# Altium project flatsat_platform_2.PrjPcb (part 1 of 2)
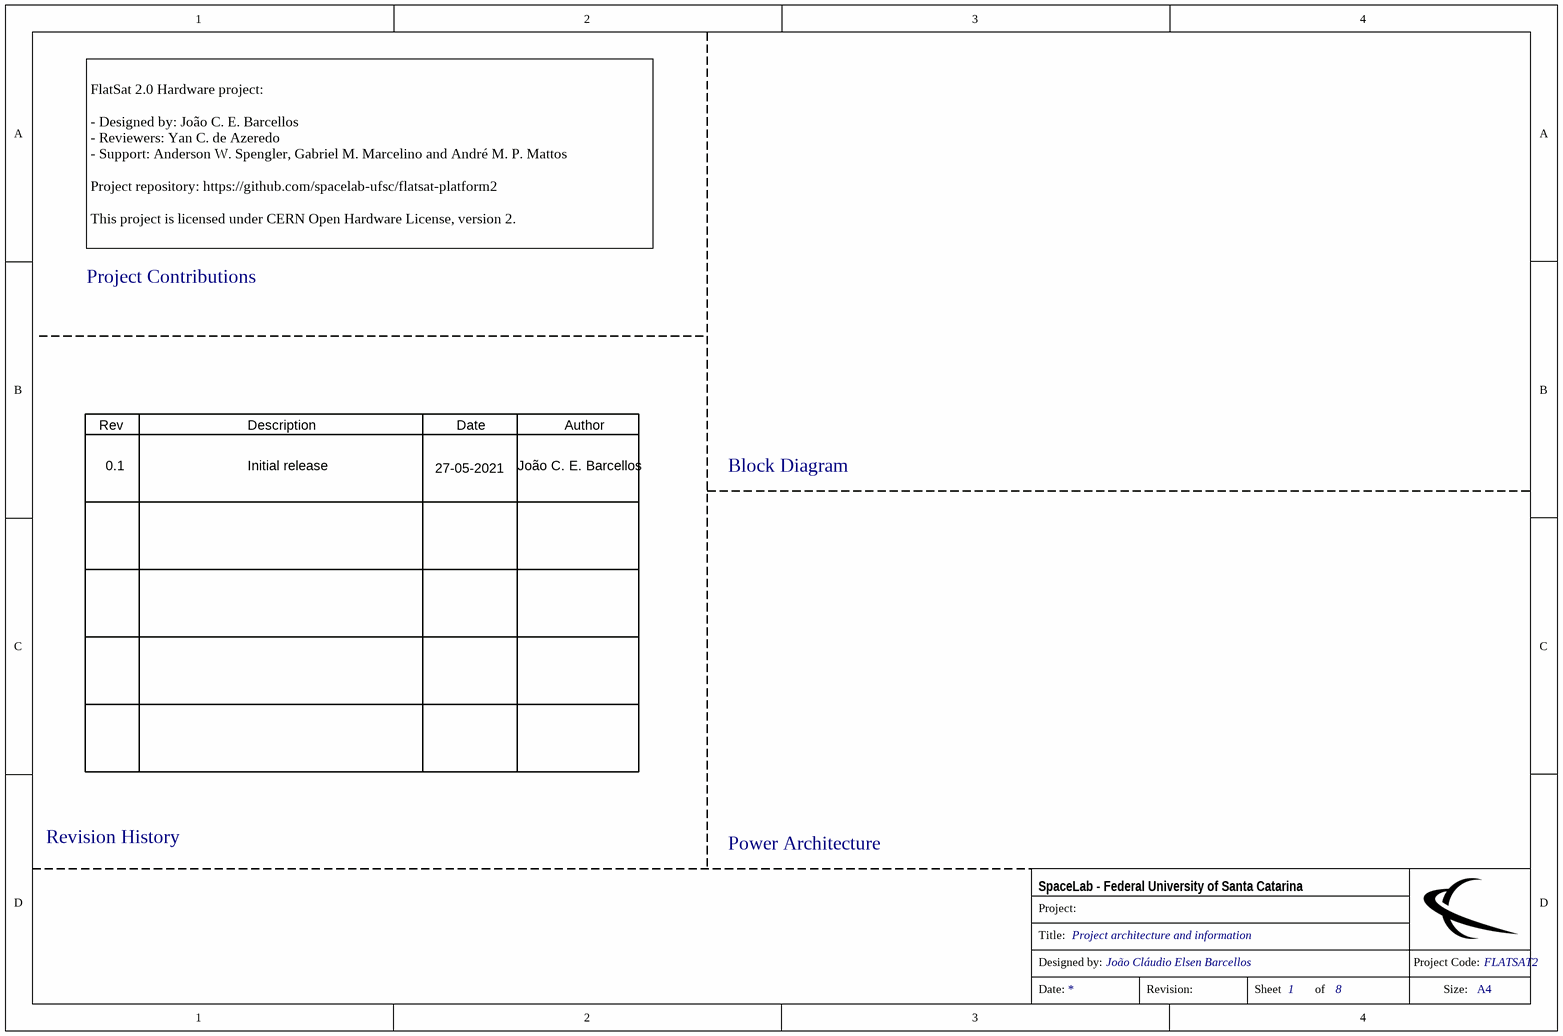
[diagram p0: architecture.SchDoc]
DesignedBy: João Cláudio Elsen Barcellos; ProjectCode: FLATSAT2; ProjectRevision: v0.1
7 sheets, 155 parts. Net scope: global (net labels, ports and power ports of the same name join across sheets).
Board file: flatsat_2_PCB.PcbDoc
Sheets:
  architecture.SchDoc
  microzed_schematic.SchDoc
  PC104_schematic.SchDoc
  voltage_level_translators_schematic.SchDoc
  CAN_schematic.SchDoc
  power_schematic.SchDoc
  kill-switches_schematic.SchDoc

## Sheet architecture.SchDoc: Project architecture and information
size A4; Organization: UFSC; DocumentNumber: 1; Revision: v0.1; SheetNumber: 1; SheetTotal: 8; ProjectCode: FLATSAT2

### Notes on the sheet
- FlatSat 2.0 Hardware project:
  - Designed by: João C. E. Barcellos
  - Reviewers: Yan C. de Azeredo
  - Support: Anderson W. Spengler, Gabriel M. Marcelino and André M. P. Mattos
  Project repository: https://github.com/spacelab-ufsc/flatsat-platform2
  This project is licensed under CERN Open Hardware License, version 2.
- Project Contributions
- Rev
- Description
- Date
- Author
- 0.1
- Initial release
- 27-05-2021
- João C. E. Barcellos
- Block Diagram
- Revision History
- Power Architecture
- Project:
- SpaceLab - Federal University of Santa Catarina
- Title:
- Designed by:
- Project Code:
- Date:
- Revision:
- Sheet
- of
- Size:
- A4

## Sheet microzed_schematic.SchDoc: Microzed Interface
size A3; Organization: Altium Limited; Address1: L3, 12a Rodborough Rd; Address2: Frenchs Forest; Address3: NSW; Address4: Australia 2086; DocumentNumber: 2; SheetNumber: 2; SheetTotal: 8
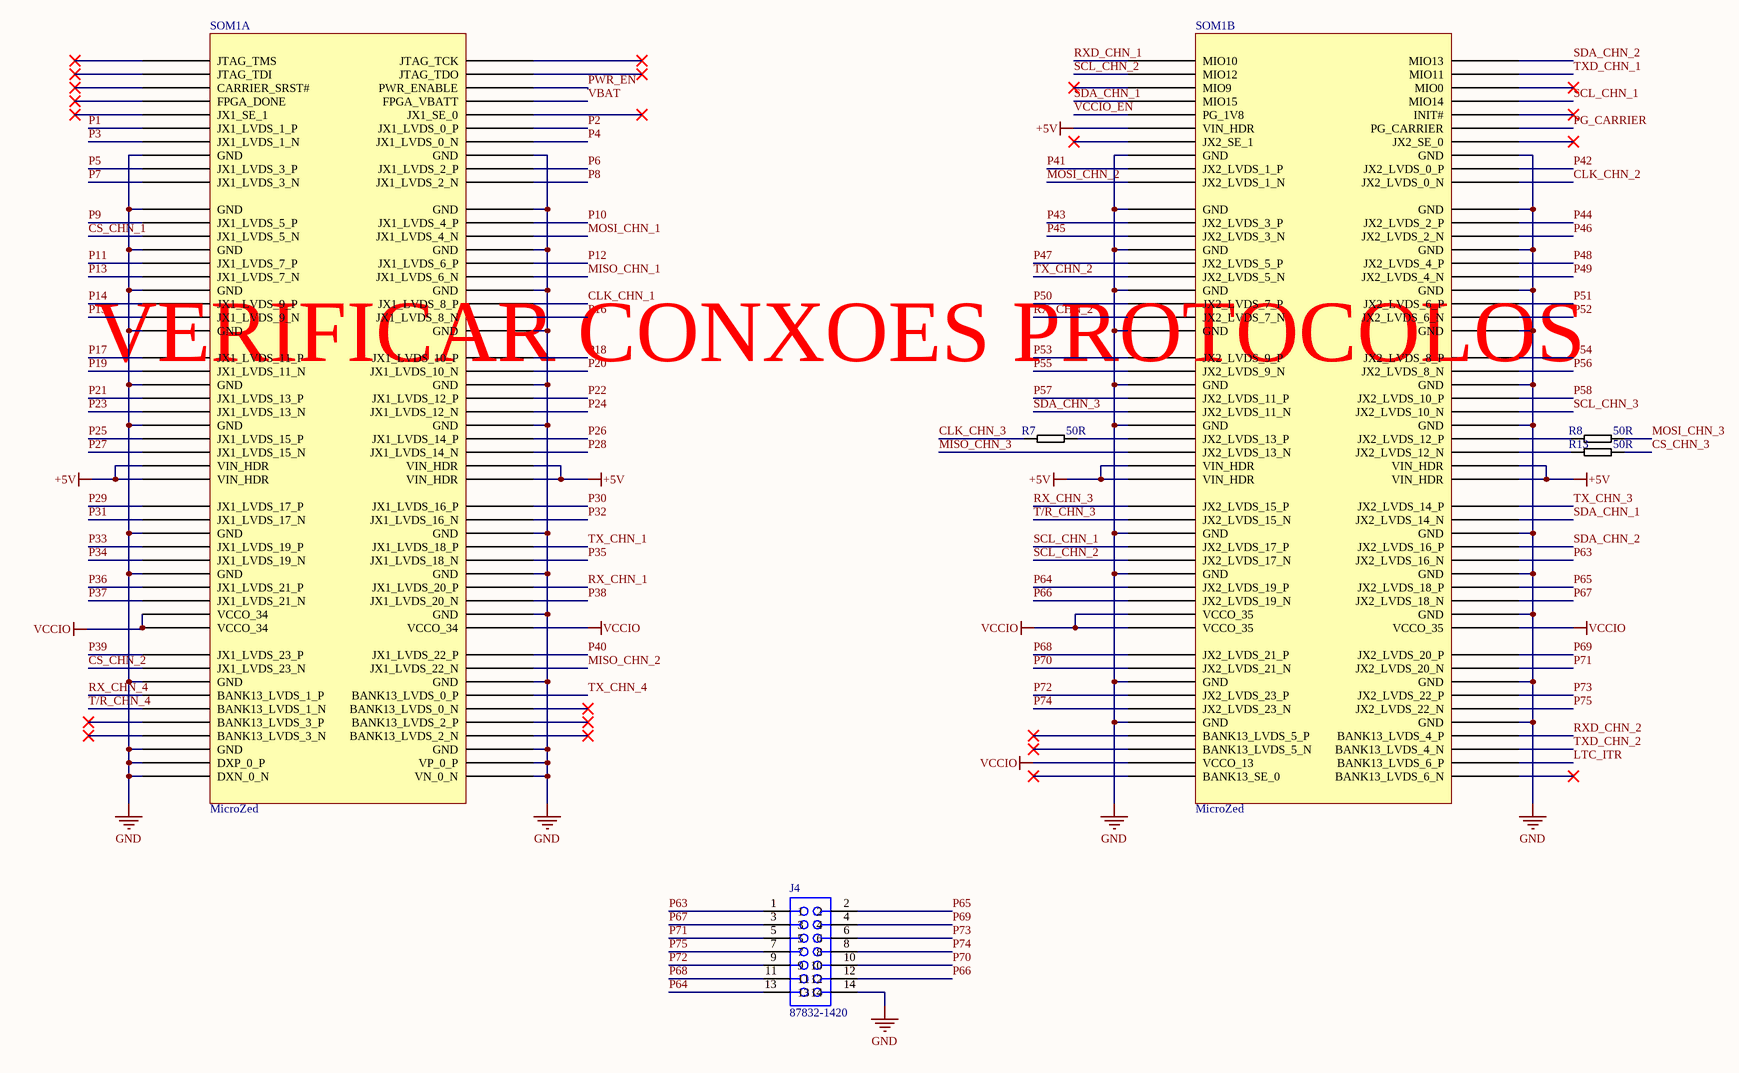
[diagram p1: microzed_schematic.SchDoc]

### Parts
J4  87832-1420  [SAMTEC_TSW-107-05-F-D]
R7  value 50R  [R0603_HD]  (hidden comment: CRCW060350R0FKEA)
R8  value 50R  [R0603_HD]  (hidden comment: CRCW060350R0FKEA)
R13  value 50R  [R0603_HD]  (hidden comment: CRCW060350R0FKEA)
SOM1  MicroZed  [MicroZedSOM]  (parts A,B of 2)

### Nets
+5V: SOM1.JX1-57(VIN_HDR) SOM1.JX1-58(VIN_HDR) SOM1.JX1-59(VIN_HDR) SOM1.JX1-60(VIN_HDR) SOM1.JX2-12(VIN_HDR) SOM1.JX2-57(VIN_HDR) SOM1.JX2-58(VIN_HDR) SOM1.JX2-59(VIN_HDR) SOM1.JX2-60(VIN_HDR)
GND: J4.14 SOM1.JX1-15(GND) SOM1.JX1-16(GND) SOM1.JX1-21(GND) SOM1.JX1-22(GND) SOM1.JX1-27(GND) SOM1.JX1-28(GND) SOM1.JX1-33(GND) SOM1.JX1-34(GND) SOM1.JX1-39(GND) SOM1.JX1-40(GND) SOM1.JX1-45(GND) SOM1.JX1-46(GND) SOM1.JX1-51(GND) SOM1.JX1-52(GND) SOM1.JX1-65(GND) SOM1.JX1-66(GND) SOM1.JX1-71(GND) SOM1.JX1-72(GND) SOM1.JX1-77(GND) SOM1.JX1-85(GND) SOM1.JX1-86(GND) SOM1.JX1-95(GND) SOM1.JX1-96(GND) SOM1.JX1-97(VP_0_P) SOM1.JX1-98(DXP_0_P) SOM1.JX1-99(VN_0_N) SOM1.JX1-100(DXN_0_N) SOM1.JX2-15(GND) SOM1.JX2-16(GND) SOM1.JX2-21(GND) SOM1.JX2-22(GND) SOM1.JX2-27(GND) SOM1.JX2-28(GND) SOM1.JX2-33(GND) SOM1.JX2-34(GND) SOM1.JX2-39(GND) SOM1.JX2-40(GND) SOM1.JX2-45(GND) SOM1.JX2-46(GND) SOM1.JX2-51(GND) SOM1.JX2-52(GND) SOM1.JX2-65(GND) SOM1.JX2-66(GND) SOM1.JX2-71(GND) SOM1.JX2-72(GND) SOM1.JX2-77(GND) SOM1.JX2-85(GND) SOM1.JX2-86(GND) SOM1.JX2-91(GND) SOM1.JX2-92(GND)
VCCIO: SOM1.JX1-78(VCCO_34) SOM1.JX1-79(VCCO_34) SOM1.JX1-80(VCCO_34) SOM1.JX2-78(VCCO_35) SOM1.JX2-79(VCCO_35) SOM1.JX2-80(VCCO_35) SOM1.JX2-98(VCCO_13)
CLK_CHN_1: SOM1.JX1-35(JX1_LVDS_8_P)
CLK_CHN_2: SOM1.JX2-19(JX2_LVDS_0_N)
CLK_CHN_3: R7.1
CS_CHN_1: SOM1.JX1-26(JX1_LVDS_5_N)
CS_CHN_2: SOM1.JX1-84(JX1_LVDS_23_N)
CS_CHN_3: R13.2
LTC_ITR: SOM1.JX2-97(BANK13_LVDS_6_P)
MISO_CHN_1: SOM1.JX1-31(JX1_LVDS_6_N)
MISO_CHN_2: SOM1.JX1-83(JX1_LVDS_22_N)
MISO_CHN_3: SOM1.JX2-56(JX2_LVDS_13_N)
MOSI_CHN_1: SOM1.JX1-25(JX1_LVDS_4_N)
MOSI_CHN_2: SOM1.JX2-20(JX2_LVDS_1_N)
MOSI_CHN_3: R8.2
P1: SOM1.JX1-12(JX1_LVDS_1_P)
P2: SOM1.JX1-11(JX1_LVDS_0_P)
P3: SOM1.JX1-14(JX1_LVDS_1_N)
P4: SOM1.JX1-13(JX1_LVDS_0_N)
P5: SOM1.JX1-18(JX1_LVDS_3_P)
P6: SOM1.JX1-17(JX1_LVDS_2_P)
P7: SOM1.JX1-20(JX1_LVDS_3_N)
P8: SOM1.JX1-19(JX1_LVDS_2_N)
P9: SOM1.JX1-24(JX1_LVDS_5_P)
P10: SOM1.JX1-23(JX1_LVDS_4_P)
P11: SOM1.JX1-30(JX1_LVDS_7_P)
P12: SOM1.JX1-29(JX1_LVDS_6_P)
P13: SOM1.JX1-32(JX1_LVDS_7_N)
P14: SOM1.JX1-36(JX1_LVDS_9_P)
P15: SOM1.JX1-38(JX1_LVDS_9_N)
P16: SOM1.JX1-37(JX1_LVDS_8_N)
P17: SOM1.JX1-42(JX1_LVDS_11_P)
P18: SOM1.JX1-41(JX1_LVDS_10_P)
P19: SOM1.JX1-44(JX1_LVDS_11_N)
P20: SOM1.JX1-43(JX1_LVDS_10_N)
P21: SOM1.JX1-48(JX1_LVDS_13_P)
P22: SOM1.JX1-47(JX1_LVDS_12_P)
P23: SOM1.JX1-50(JX1_LVDS_13_N)
P24: SOM1.JX1-49(JX1_LVDS_12_N)
P25: SOM1.JX1-54(JX1_LVDS_15_P)
P26: SOM1.JX1-53(JX1_LVDS_14_P)
P27: SOM1.JX1-56(JX1_LVDS_15_N)
P28: SOM1.JX1-55(JX1_LVDS_14_N)
P29: SOM1.JX1-62(JX1_LVDS_17_P)
P30: SOM1.JX1-61(JX1_LVDS_16_P)
P31: SOM1.JX1-64(JX1_LVDS_17_N)
P32: SOM1.JX1-63(JX1_LVDS_16_N)
P33: SOM1.JX1-68(JX1_LVDS_19_P)
P34: SOM1.JX1-70(JX1_LVDS_19_N)
P35: SOM1.JX1-69(JX1_LVDS_18_N)
P36: SOM1.JX1-74(JX1_LVDS_21_P)
P37: SOM1.JX1-76(JX1_LVDS_21_N)
P38: SOM1.JX1-75(JX1_LVDS_20_N)
P39: SOM1.JX1-82(JX1_LVDS_23_P)
P40: SOM1.JX1-81(JX1_LVDS_22_P)
P41: SOM1.JX2-18(JX2_LVDS_1_P)
P42: SOM1.JX2-17(JX2_LVDS_0_P)
P43: SOM1.JX2-24(JX2_LVDS_3_P)
P44: SOM1.JX2-23(JX2_LVDS_2_P)
P45: SOM1.JX2-26(JX2_LVDS_3_N)
P46: SOM1.JX2-25(JX2_LVDS_2_N)
P47: SOM1.JX2-30(JX2_LVDS_5_P)
P48: SOM1.JX2-29(JX2_LVDS_4_P)
P49: SOM1.JX2-31(JX2_LVDS_4_N)
P50: SOM1.JX2-36(JX2_LVDS_7_P)
P51: SOM1.JX2-35(JX2_LVDS_6_P)
P52: SOM1.JX2-37(JX2_LVDS_6_N)
P53: SOM1.JX2-42(JX2_LVDS_9_P)
P54: SOM1.JX2-41(JX2_LVDS_8_P)
P55: SOM1.JX2-44(JX2_LVDS_9_N)
P56: SOM1.JX2-43(JX2_LVDS_8_N)
P57: SOM1.JX2-48(JX2_LVDS_11_P)
P58: SOM1.JX2-47(JX2_LVDS_10_P)
P63: J4.1 SOM1.JX2-69(JX2_LVDS_16_N)
P64: J4.13 SOM1.JX2-74(JX2_LVDS_19_P)
P65: J4.2 SOM1.JX2-73(JX2_LVDS_18_P)
P66: J4.12 SOM1.JX2-76(JX2_LVDS_19_N)
P67: J4.3 SOM1.JX2-75(JX2_LVDS_18_N)
P68: J4.11 SOM1.JX2-82(JX2_LVDS_21_P)
P69: J4.4 SOM1.JX2-81(JX2_LVDS_20_P)
P70: J4.10 SOM1.JX2-84(JX2_LVDS_21_N)
P71: J4.5 SOM1.JX2-83(JX2_LVDS_20_N)
P72: J4.9 SOM1.JX2-88(JX2_LVDS_23_P)
P73: J4.6 SOM1.JX2-87(JX2_LVDS_22_P)
P74: J4.8 SOM1.JX2-90(JX2_LVDS_23_N)
P75: J4.7 SOM1.JX2-89(JX2_LVDS_22_N)
PG_CARRIER: SOM1.JX2-11(PG_CARRIER)
PWR_EN: SOM1.JX1-5(PWR_ENABLE)
RX_CHN_1: SOM1.JX1-73(JX1_LVDS_20_P)
RX_CHN_2: SOM1.JX2-38(JX2_LVDS_7_N)
RX_CHN_3: SOM1.JX2-62(JX2_LVDS_15_P)
RX_CHN_4: SOM1.JX1-88(BANK13_LVDS_1_P)
RXD_CHN_1: SOM1.JX2-2(MIO10)
RXD_CHN_2: SOM1.JX2-93(BANK13_LVDS_4_P)
SCL_CHN_1: SOM1.JX2-7(MIO14) SOM1.JX2-68(JX2_LVDS_17_P)
SCL_CHN_2: SOM1.JX2-4(MIO12) SOM1.JX2-70(JX2_LVDS_17_N)
SCL_CHN_3: SOM1.JX2-49(JX2_LVDS_10_N)
SDA_CHN_1: SOM1.JX2-8(MIO15) SOM1.JX2-63(JX2_LVDS_14_N)
SDA_CHN_2: SOM1.JX2-1(MIO13) SOM1.JX2-67(JX2_LVDS_16_P)
SDA_CHN_3: SOM1.JX2-50(JX2_LVDS_11_N)
T/R_CHN_3: SOM1.JX2-64(JX2_LVDS_15_N)
T/R_CHN_4: SOM1.JX1-90(BANK13_LVDS_1_N)
TX_CHN_1: SOM1.JX1-67(JX1_LVDS_18_P)
TX_CHN_2: SOM1.JX2-32(JX2_LVDS_5_N)
TX_CHN_3: SOM1.JX2-61(JX2_LVDS_14_P)
TX_CHN_4: SOM1.JX1-87(BANK13_LVDS_0_P)
TXD_CHN_1: SOM1.JX2-3(MIO11)
TXD_CHN_2: SOM1.JX2-95(BANK13_LVDS_4_N)
VBAT: SOM1.JX1-7(FPGA_VBATT)
VCCIO_EN: SOM1.JX2-10(PG_1V8)
NetR7_2: R7.2 SOM1.JX2-54(JX2_LVDS_13_P)
NetR8_1: R8.1 SOM1.JX2-53(JX2_LVDS_12_P)
NetR13_1: R13.1 SOM1.JX2-55(JX2_LVDS_12_N)

Not connected (* = marked no-connect by the designer): SOM1 JX1-1(JTAG_TCK)* JX1-2(JTAG_TMS)* JX1-3(JTAG_TDO)* JX1-4(JTAG_TDI)* JX1-6(CARRIER_SRST#)* JX1-8(FPGA_DONE)* JX1-9(JX1_SE_0)* JX1-10(JX1_SE_1)* JX1-89(BANK13_LVDS_0_N)* JX1-91(BANK13_LVDS_2_P)* JX1-92(BANK13_LVDS_3_P)* JX1-93(BANK13_LVDS_2_N)* JX1-94(BANK13_LVDS_3_N)* JX2-5(MIO0)* JX2-6(MIO9)* JX2-9(INIT#)* JX2-13(JX2_SE_0)* JX2-14(JX2_SE_1)* JX2-94(BANK13_LVDS_5_P)* JX2-96(BANK13_LVDS_5_N)* JX2-99(BANK13_LVDS_6_N)* JX2-100(BANK13_SE_0)*

### Notes on the sheet
- (near SOM1) VERIFICAR CONXOES PROTOCOLOS
- Project:
- SpaceLab - Federal University of Santa Catarina
- Title:
- Engineer:
- Project Code:
- Date:
- Revision:
- Sheet
- of
- Size:
- A3

### Library data of the parts
J4 = 87832-1420: Connector Header Surface Mount 14 position 0.079 _2.00mm_; Manufacturer Part Number: TSW-107-05-F-D; MF: Molex; Value: *; SnapEDA_Link: https://www.snapeda.com/parts/87832-1420/Molex/view-part/78740/?ref=snap; Price: None; Package: None; Availability: Unavailable
R7 R8 R13 = CRCW060350R0FKEA: RES SMD 50 OHM 1% 1/10W 0603; Manufacturer: Vishay Dale; Mount Type: SMD; Tolerance: 1%; Supplier 1: Digi-Key; Supplier Part Number 1: 541-3318-1-ND; Power: 1/10W
SOM1 = MicroZed_SOM: MicroZed SOM Carrier Footprint; Manufacturer Part Number: 61083-101400LF

## Sheet PC104_schematic.SchDoc: PC104 Interfaces
size A2; DocumentNumber: 3; SheetNumber: 3; SheetTotal: 8
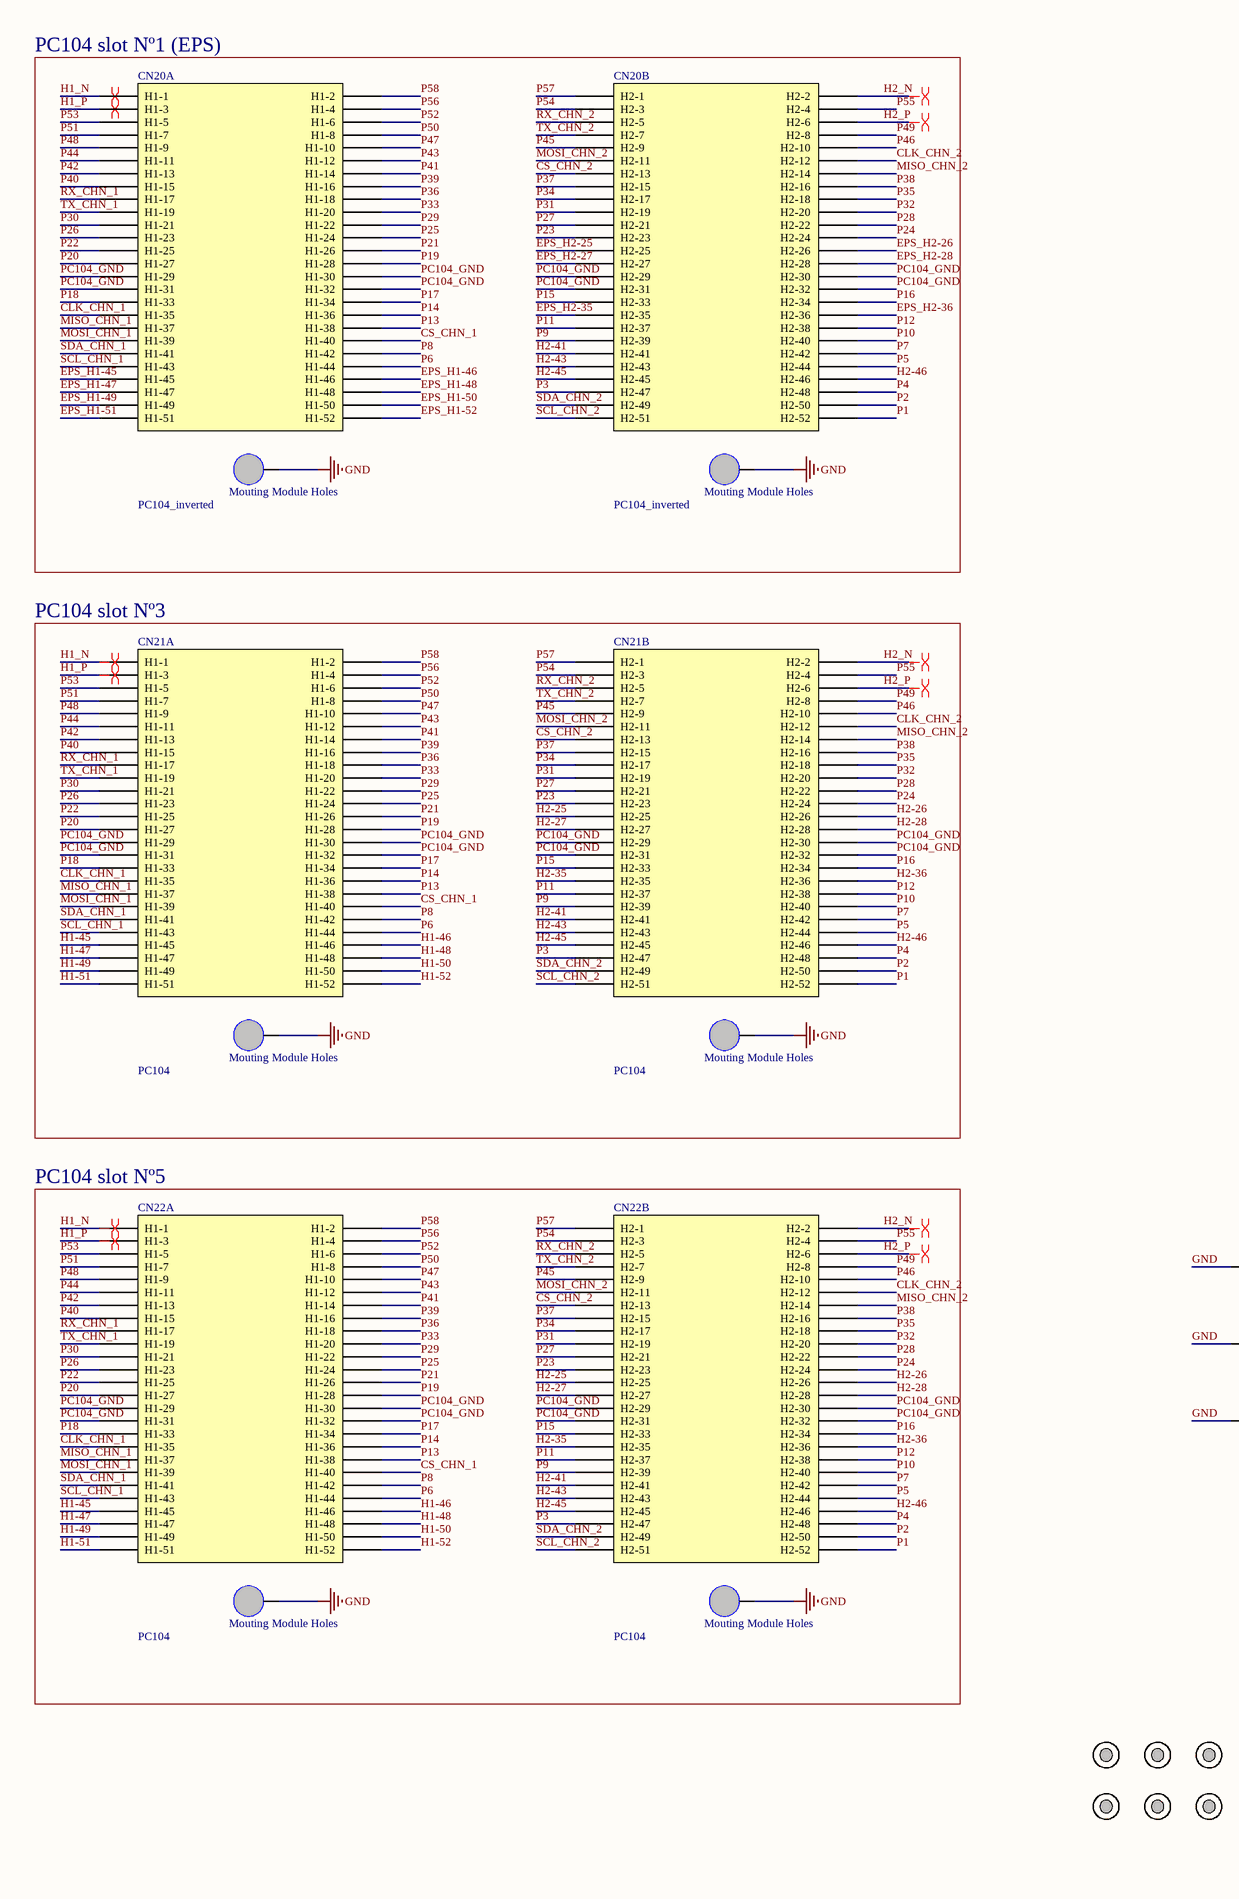
[diagram p2: PC104_schematic.SchDoc, left]
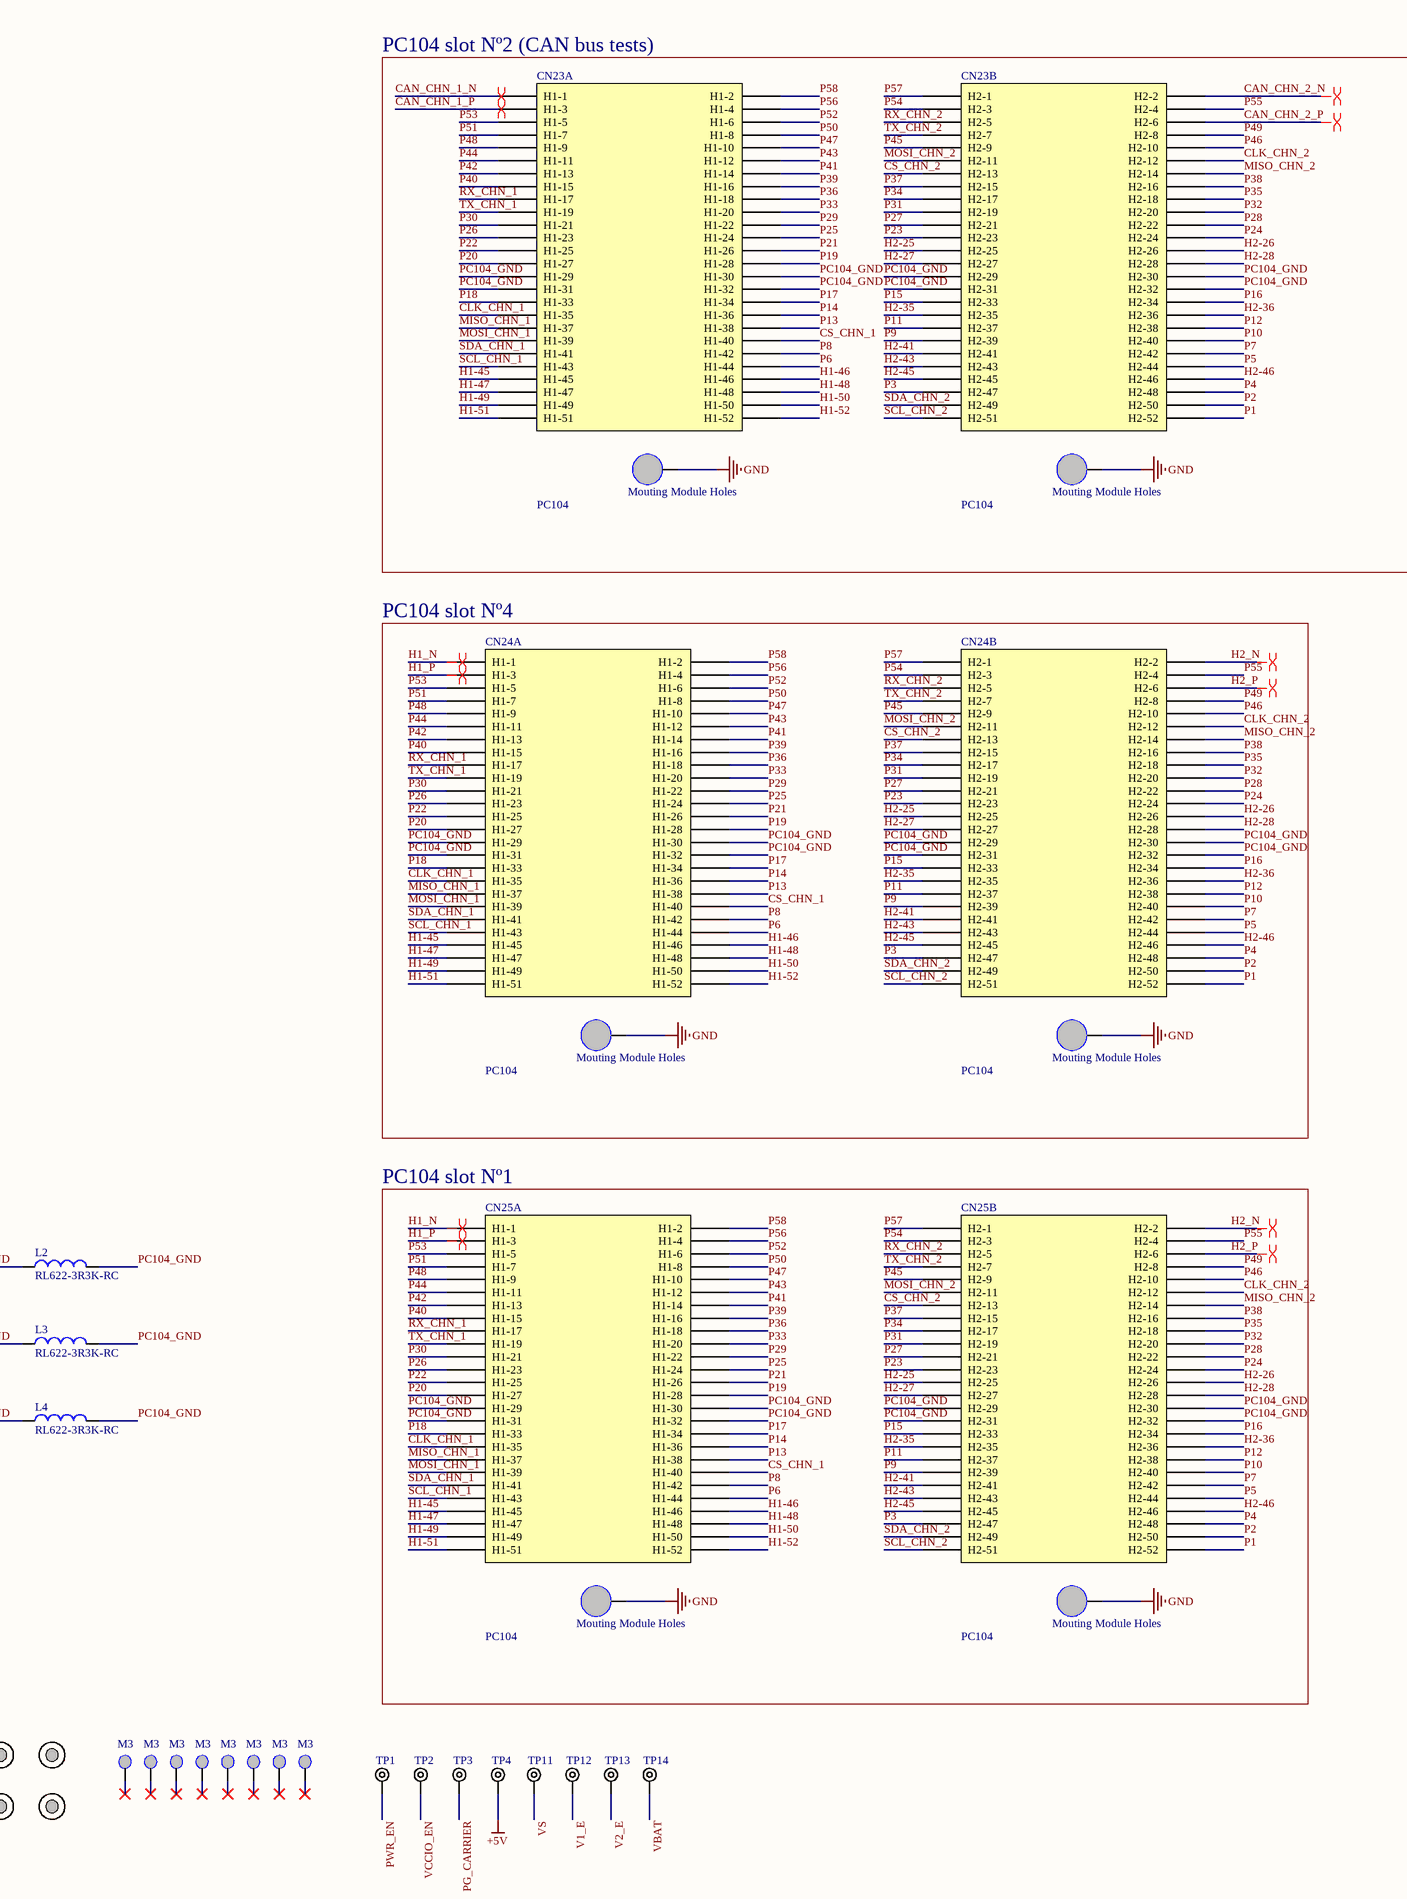
[diagram p3: PC104_schematic.SchDoc, right]

### Parts
CN20  PC104_inverted  [PC104_inverted]  (parts A,B of 2)
CN21  PC104  [PC104]  (parts A,B of 2)
CN22  PC104  [PC104]  (parts A,B of 2)
CN23  PC104  [PC104]  (parts A,B of 2)
CN24  PC104  [PC104]  (parts A,B of 2)
CN25  PC104  [PC104]  (parts A,B of 2)
FD1  Fiducial 1.3  [Fiducial 1.3mm]  (value not drawn)  (no BOM)
FD2  Fiducial 1.3  [Fiducial 1.3mm]  (value not drawn)  (no BOM)
FD3  Fiducial 1.3  [Fiducial 1.3mm]  (value not drawn)  (no BOM)
FD4  Fiducial 1.3  [Fiducial 1.3mm]  (value not drawn)  (no BOM)
FD5  Fiducial 1.3  [Fiducial 1.3mm]  (value not drawn)  (no BOM)
FD6  Fiducial 1.3  [Fiducial 1.3mm]  (value not drawn)  (no BOM)
FD7  Fiducial 1.3  [Fiducial 1.3mm]  (value not drawn)  (no BOM)
FD8  Fiducial 1.3  [Fiducial 1.3mm]  (value not drawn)  (no BOM)
L2  RL622-3R3K-RC  [RL622]
L3  RL622-3R3K-RC  [RL622]
L4  RL622-3R3K-RC  [RL622]
MEC1  M3  [M3 hole]  (no BOM)
MEC2  M3  [M3 hole]  (no BOM)
MEC3  M3  [M3 hole]  (no BOM)
MEC4  M3  [M3 hole]  (no BOM)
MEC5  M3  [M3 hole]  (no BOM)
MEC6  M3  [M3 hole]  (no BOM)
MEC7  M3  [M3 hole]  (no BOM)
MEC8  M3  [M3 hole]  (no BOM)
TP1  (no value)  [TEST POINT PTH]  (no BOM)
TP2  (no value)  [TEST POINT PTH]  (no BOM)
TP3  (no value)  [TEST POINT PTH]  (no BOM)
TP4  (no value)  [TEST POINT PTH]  (no BOM)
TP11  (no value)  [TEST POINT PTH]  (no BOM)
TP12  (no value)  [TEST POINT PTH]  (no BOM)
TP13  (no value)  [TEST POINT PTH]  (no BOM)
TP14  (no value)  [TEST POINT PTH]  (no BOM)

### Blocks framed on the sheet
PC104 slot Nº1 (EPS): CN20
PC104 slot Nº2 (CAN bus tests): CN23
PC104 slot Nº3: CN21
PC104 slot Nº4: CN24
PC104 slot Nº5: CN22
PC104 slot Nº1: CN25

### Nets
+5V: TP4.1
GND: CN20.0(Mouting) CN21.0(Mouting) CN22.0(Mouting) CN23.0(Mouting) CN24.0(Mouting) CN25.0(Mouting) L2.1 L3.1 L4.1
CAN_CHN_1_N: CN23.1(H1-1)
CAN_CHN_1_P: CN23.3(H1-3)
CAN_CHN_2_N: CN23.54(H2-2)
CAN_CHN_2_P: CN23.58(H2-6)
CLK_CHN_1: CN20.35(H1-35) CN21.35(H1-35) CN22.35(H1-35) CN23.35(H1-35) CN24.35(H1-35) CN25.35(H1-35)
CLK_CHN_2: CN20.64(H2-12) CN21.64(H2-12) CN22.64(H2-12) CN23.64(H2-12) CN24.64(H2-12) CN25.64(H2-12)
CS_CHN_1: CN20.40(H1-40) CN21.40(H1-40) CN22.40(H1-40) CN23.40(H1-40) CN24.40(H1-40) CN25.40(H1-40)
CS_CHN_2: CN20.65(H2-13) CN21.65(H2-13) CN22.65(H2-13) CN23.65(H2-13) CN24.65(H2-13) CN25.65(H2-13)
EPS_H1-45: CN20.45(H1-45) CN20.46(H1-46)  [also labelled EPS_H1-46]
EPS_H1-47: CN20.47(H1-47) CN20.48(H1-48)  [also labelled EPS_H1-48]
EPS_H1-49: CN20.49(H1-49) CN20.50(H1-50)  [also labelled EPS_H1-50]
EPS_H1-51: CN20.51(H1-51) CN20.52(H1-52)  [also labelled EPS_H1-52]
EPS_H2-25: CN20.77(H2-25) CN20.78(H2-26)  [also labelled EPS_H2-26]
EPS_H2-27: CN20.79(H2-27) CN20.80(H2-28)  [also labelled EPS_H2-28]
EPS_H2-35: CN20.87(H2-35) CN20.88(H2-36)  [also labelled EPS_H2-36]
H1-45: CN21.45(H1-45) CN21.46(H1-46) CN22.45(H1-45) CN22.46(H1-46) CN23.45(H1-45) CN23.46(H1-46) CN24.45(H1-45) CN24.46(H1-46) CN25.45(H1-45) CN25.46(H1-46)  [also labelled H1-46]
H1-47: CN21.47(H1-47) CN21.48(H1-48) CN22.47(H1-47) CN22.48(H1-48) CN23.47(H1-47) CN23.48(H1-48) CN24.47(H1-47) CN24.48(H1-48) CN25.47(H1-47) CN25.48(H1-48)  [also labelled H1-48]
H1-49: CN21.49(H1-49) CN21.50(H1-50) CN22.49(H1-49) CN22.50(H1-50) CN23.49(H1-49) CN23.50(H1-50) CN24.49(H1-49) CN24.50(H1-50) CN25.49(H1-49) CN25.50(H1-50)  [also labelled H1-50]
H1-51: CN21.51(H1-51) CN21.52(H1-52) CN22.51(H1-51) CN22.52(H1-52) CN23.51(H1-51) CN23.52(H1-52) CN24.51(H1-51) CN24.52(H1-52) CN25.51(H1-51) CN25.52(H1-52)  [also labelled H1-52]
H1_N: CN20.1(H1-1) CN21.1(H1-1) CN22.1(H1-1) CN24.1(H1-1) CN25.1(H1-1)
H1_P: CN20.3(H1-3) CN21.3(H1-3) CN22.3(H1-3) CN24.3(H1-3) CN25.3(H1-3)
H2-25: CN21.77(H2-25) CN21.78(H2-26) CN22.77(H2-25) CN22.78(H2-26) CN23.77(H2-25) CN23.78(H2-26) CN24.77(H2-25) CN24.78(H2-26) CN25.77(H2-25) CN25.78(H2-26)  [also labelled H2-26]
H2-27: CN21.79(H2-27) CN21.80(H2-28) CN22.79(H2-27) CN22.80(H2-28) CN23.79(H2-27) CN23.80(H2-28) CN24.79(H2-27) CN24.80(H2-28) CN25.79(H2-27) CN25.80(H2-28)  [also labelled H2-28]
H2-35: CN21.87(H2-35) CN21.88(H2-36) CN22.87(H2-35) CN22.88(H2-36) CN23.87(H2-35) CN23.88(H2-36) CN24.87(H2-35) CN24.88(H2-36) CN25.87(H2-35) CN25.88(H2-36)  [also labelled H2-36]
H2-41: CN20.93(H2-41) CN21.93(H2-41) CN22.93(H2-41) CN23.93(H2-41) CN24.93(H2-41) CN25.93(H2-41)
H2-43: CN20.95(H2-43) CN21.95(H2-43) CN22.95(H2-43) CN23.95(H2-43) CN24.95(H2-43) CN25.95(H2-43)
H2-45: CN20.97(H2-45) CN21.97(H2-45) CN22.97(H2-45) CN23.97(H2-45) CN24.97(H2-45) CN25.97(H2-45)
H2-46: CN20.98(H2-46) CN21.98(H2-46) CN22.98(H2-46) CN23.98(H2-46) CN24.98(H2-46) CN25.98(H2-46)
H2_N: CN20.54(H2-2) CN21.54(H2-2) CN22.54(H2-2) CN24.54(H2-2) CN25.54(H2-2)
H2_P: CN20.58(H2-6) CN21.58(H2-6) CN22.58(H2-6) CN24.58(H2-6) CN25.58(H2-6)
MISO_CHN_1: CN20.37(H1-37) CN21.37(H1-37) CN22.37(H1-37) CN23.37(H1-37) CN24.37(H1-37) CN25.37(H1-37)
MISO_CHN_2: CN20.66(H2-14) CN21.66(H2-14) CN22.66(H2-14) CN23.66(H2-14) CN24.66(H2-14) CN25.66(H2-14)
MOSI_CHN_1: CN20.39(H1-39) CN21.39(H1-39) CN22.39(H1-39) CN23.39(H1-39) CN24.39(H1-39) CN25.39(H1-39)
MOSI_CHN_2: CN20.63(H2-11) CN21.63(H2-11) CN22.63(H2-11) CN23.63(H2-11) CN24.63(H2-11) CN25.63(H2-11)
P1: CN20.104(H2-52) CN21.104(H2-52) CN22.104(H2-52) CN23.104(H2-52) CN24.104(H2-52) CN25.104(H2-52)
P2: CN20.102(H2-50) CN21.102(H2-50) CN22.102(H2-50) CN23.102(H2-50) CN24.102(H2-50) CN25.102(H2-50)
P3: CN20.99(H2-47) CN21.99(H2-47) CN22.99(H2-47) CN23.99(H2-47) CN24.99(H2-47) CN25.99(H2-47)
P4: CN20.100(H2-48) CN21.100(H2-48) CN22.100(H2-48) CN23.100(H2-48) CN24.100(H2-48) CN25.100(H2-48)
P5: CN20.96(H2-44) CN21.96(H2-44) CN22.96(H2-44) CN23.96(H2-44) CN24.96(H2-44) CN25.96(H2-44)
P6: CN20.44(H1-44) CN21.44(H1-44) CN22.44(H1-44) CN23.44(H1-44) CN24.44(H1-44) CN25.44(H1-44)
P7: CN20.94(H2-42) CN21.94(H2-42) CN22.94(H2-42) CN23.94(H2-42) CN24.94(H2-42) CN25.94(H2-42)
P8: CN20.42(H1-42) CN21.42(H1-42) CN22.42(H1-42) CN23.42(H1-42) CN24.42(H1-42) CN25.42(H1-42)
P9: CN20.91(H2-39) CN21.91(H2-39) CN22.91(H2-39) CN23.91(H2-39) CN24.91(H2-39) CN25.91(H2-39)
P10: CN20.92(H2-40) CN21.92(H2-40) CN22.92(H2-40) CN23.92(H2-40) CN24.92(H2-40) CN25.92(H2-40)
P11: CN20.89(H2-37) CN21.89(H2-37) CN22.89(H2-37) CN23.89(H2-37) CN24.89(H2-37) CN25.89(H2-37)
P12: CN20.90(H2-38) CN21.90(H2-38) CN22.90(H2-38) CN23.90(H2-38) CN24.90(H2-38) CN25.90(H2-38)
P13: CN20.38(H1-38) CN21.38(H1-38) CN22.38(H1-38) CN23.38(H1-38) CN24.38(H1-38) CN25.38(H1-38)
P14: CN20.36(H1-36) CN21.36(H1-36) CN22.36(H1-36) CN23.36(H1-36) CN24.36(H1-36) CN25.36(H1-36)
P15: CN20.85(H2-33) CN21.85(H2-33) CN22.85(H2-33) CN23.85(H2-33) CN24.85(H2-33) CN25.85(H2-33)
P16: CN20.86(H2-34) CN21.86(H2-34) CN22.86(H2-34) CN23.86(H2-34) CN24.86(H2-34) CN25.86(H2-34)
P17: CN20.34(H1-34) CN21.34(H1-34) CN22.34(H1-34) CN23.34(H1-34) CN24.34(H1-34) CN25.34(H1-34)
P18: CN20.33(H1-33) CN21.33(H1-33) CN22.33(H1-33) CN23.33(H1-33) CN24.33(H1-33) CN25.33(H1-33)
P19: CN20.28(H1-28) CN21.28(H1-28) CN22.28(H1-28) CN23.28(H1-28) CN24.28(H1-28) CN25.28(H1-28)
P20: CN20.27(H1-27) CN21.27(H1-27) CN22.27(H1-27) CN23.27(H1-27) CN24.27(H1-27) CN25.27(H1-27)
P21: CN20.26(H1-26) CN21.26(H1-26) CN22.26(H1-26) CN23.26(H1-26) CN24.26(H1-26) CN25.26(H1-26)
P22: CN20.25(H1-25) CN21.25(H1-25) CN22.25(H1-25) CN23.25(H1-25) CN24.25(H1-25) CN25.25(H1-25)
P23: CN20.75(H2-23) CN21.75(H2-23) CN22.75(H2-23) CN23.75(H2-23) CN24.75(H2-23) CN25.75(H2-23)
P24: CN20.76(H2-24) CN21.76(H2-24) CN22.76(H2-24) CN23.76(H2-24) CN24.76(H2-24) CN25.76(H2-24)
P25: CN20.24(H1-24) CN21.24(H1-24) CN22.24(H1-24) CN23.24(H1-24) CN24.24(H1-24) CN25.24(H1-24)
P26: CN20.23(H1-23) CN21.23(H1-23) CN22.23(H1-23) CN23.23(H1-23) CN24.23(H1-23) CN25.23(H1-23)
P27: CN20.73(H2-21) CN21.73(H2-21) CN22.73(H2-21) CN23.73(H2-21) CN24.73(H2-21) CN25.73(H2-21)
P28: CN20.74(H2-22) CN21.74(H2-22) CN22.74(H2-22) CN23.74(H2-22) CN24.74(H2-22) CN25.74(H2-22)
P29: CN20.22(H1-22) CN21.22(H1-22) CN22.22(H1-22) CN23.22(H1-22) CN24.22(H1-22) CN25.22(H1-22)
P30: CN20.21(H1-21) CN21.21(H1-21) CN22.21(H1-21) CN23.21(H1-21) CN24.21(H1-21) CN25.21(H1-21)
P31: CN20.71(H2-19) CN21.71(H2-19) CN22.71(H2-19) CN23.71(H2-19) CN24.71(H2-19) CN25.71(H2-19)
P32: CN20.72(H2-20) CN21.72(H2-20) CN22.72(H2-20) CN23.72(H2-20) CN24.72(H2-20) CN25.72(H2-20)
P33: CN20.20(H1-20) CN21.20(H1-20) CN22.20(H1-20) CN23.20(H1-20) CN24.20(H1-20) CN25.20(H1-20)
P34: CN20.69(H2-17) CN21.69(H2-17) CN22.69(H2-17) CN23.69(H2-17) CN24.69(H2-17) CN25.69(H2-17)
P35: CN20.70(H2-18) CN21.70(H2-18) CN22.70(H2-18) CN23.70(H2-18) CN24.70(H2-18) CN25.70(H2-18)
P36: CN20.18(H1-18) CN21.18(H1-18) CN22.18(H1-18) CN23.18(H1-18) CN24.18(H1-18) CN25.18(H1-18)
P37: CN20.67(H2-15) CN21.67(H2-15) CN22.67(H2-15) CN23.67(H2-15) CN24.67(H2-15) CN25.67(H2-15)
P38: CN20.68(H2-16) CN21.68(H2-16) CN22.68(H2-16) CN23.68(H2-16) CN24.68(H2-16) CN25.68(H2-16)
P39: CN20.16(H1-16) CN21.16(H1-16) CN22.16(H1-16) CN23.16(H1-16) CN24.16(H1-16) CN25.16(H1-16)
P40: CN20.15(H1-15) CN21.15(H1-15) CN22.15(H1-15) CN23.15(H1-15) CN24.15(H1-15) CN25.15(H1-15)
P41: CN20.14(H1-14) CN21.14(H1-14) CN22.14(H1-14) CN23.14(H1-14) CN24.14(H1-14) CN25.14(H1-14)
P42: CN20.13(H1-13) CN21.13(H1-13) CN22.13(H1-13) CN23.13(H1-13) CN24.13(H1-13) CN25.13(H1-13)
P43: CN20.12(H1-12) CN21.12(H1-12) CN22.12(H1-12) CN23.12(H1-12) CN24.12(H1-12) CN25.12(H1-12)
P44: CN20.11(H1-11) CN21.11(H1-11) CN22.11(H1-11) CN23.11(H1-11) CN24.11(H1-11) CN25.11(H1-11)
P45: CN20.61(H2-9) CN21.61(H2-9) CN22.61(H2-9) CN23.61(H2-9) CN24.61(H2-9) CN25.61(H2-9)
P46: CN20.62(H2-10) CN21.62(H2-10) CN22.62(H2-10) CN23.62(H2-10) CN24.62(H2-10) CN25.62(H2-10)
P47: CN20.10(H1-10) CN21.10(H1-10) CN22.10(H1-10) CN23.10(H1-10) CN24.10(H1-10) CN25.10(H1-10)
P48: CN20.9(H1-9) CN21.9(H1-9) CN22.9(H1-9) CN23.9(H1-9) CN24.9(H1-9) CN25.9(H1-9)
P49: CN20.60(H2-8) CN21.60(H2-8) CN22.60(H2-8) CN23.60(H2-8) CN24.60(H2-8) CN25.60(H2-8)
P50: CN20.8(H1-8) CN21.8(H1-8) CN22.8(H1-8) CN23.8(H1-8) CN24.8(H1-8) CN25.8(H1-8)
P51: CN20.7(H1-7) CN21.7(H1-7) CN22.7(H1-7) CN23.7(H1-7) CN24.7(H1-7) CN25.7(H1-7)
P52: CN20.6(H1-6) CN21.6(H1-6) CN22.6(H1-6) CN23.6(H1-6) CN24.6(H1-6) CN25.6(H1-6)
P53: CN20.5(H1-5) CN21.5(H1-5) CN22.5(H1-5) CN23.5(H1-5) CN24.5(H1-5) CN25.5(H1-5)
P54: CN20.55(H2-3) CN21.55(H2-3) CN22.55(H2-3) CN23.55(H2-3) CN24.55(H2-3) CN25.55(H2-3)
P55: CN20.56(H2-4) CN21.56(H2-4) CN22.56(H2-4) CN23.56(H2-4) CN24.56(H2-4) CN25.56(H2-4)
P56: CN20.4(H1-4) CN21.4(H1-4) CN22.4(H1-4) CN23.4(H1-4) CN24.4(H1-4) CN25.4(H1-4)
P57: CN20.53(H2-1) CN21.53(H2-1) CN22.53(H2-1) CN23.53(H2-1) CN24.53(H2-1) CN25.53(H2-1)
P58: CN20.2(H1-2) CN21.2(H1-2) CN22.2(H1-2) CN23.2(H1-2) CN24.2(H1-2) CN25.2(H1-2)
PC104_GND: CN20.29(H1-29) CN20.30(H1-30) CN20.31(H1-31) CN20.32(H1-32) CN20.81(H2-29) CN20.82(H2-30) CN20.83(H2-31) CN20.84(H2-32) CN21.29(H1-29) CN21.30(H1-30) CN21.31(H1-31) CN21.32(H1-32) CN21.81(H2-29) CN21.82(H2-30) CN21.83(H2-31) CN21.84(H2-32) CN22.29(H1-29) CN22.30(H1-30) CN22.31(H1-31) CN22.32(H1-32) CN22.81(H2-29) CN22.82(H2-30) CN22.83(H2-31) CN22.84(H2-32) CN23.29(H1-29) CN23.30(H1-30) CN23.31(H1-31) CN23.32(H1-32) CN23.81(H2-29) CN23.82(H2-30) CN23.83(H2-31) CN23.84(H2-32) CN24.29(H1-29) CN24.30(H1-30) CN24.31(H1-31) CN24.32(H1-32) CN24.81(H2-29) CN24.82(H2-30) CN24.83(H2-31) CN24.84(H2-32) CN25.29(H1-29) CN25.30(H1-30) CN25.31(H1-31) CN25.32(H1-32) CN25.81(H2-29) CN25.82(H2-30) CN25.83(H2-31) CN25.84(H2-32) L2.2 L3.2 L4.2
PG_CARRIER: TP3.1
PWR_EN: TP1.1
RX_CHN_1: CN20.17(H1-17) CN21.17(H1-17) CN22.17(H1-17) CN23.17(H1-17) CN24.17(H1-17) CN25.17(H1-17)
RX_CHN_2: CN20.57(H2-5) CN21.57(H2-5) CN22.57(H2-5) CN23.57(H2-5) CN24.57(H2-5) CN25.57(H2-5)
SCL_CHN_1: CN20.43(H1-43) CN21.43(H1-43) CN22.43(H1-43) CN23.43(H1-43) CN24.43(H1-43) CN25.43(H1-43)
SCL_CHN_2: CN20.103(H2-51) CN21.103(H2-51) CN22.103(H2-51) CN23.103(H2-51) CN24.103(H2-51) CN25.103(H2-51)
SDA_CHN_1: CN20.41(H1-41) CN21.41(H1-41) CN22.41(H1-41) CN23.41(H1-41) CN24.41(H1-41) CN25.41(H1-41)
SDA_CHN_2: CN20.101(H2-49) CN21.101(H2-49) CN22.101(H2-49) CN23.101(H2-49) CN24.101(H2-49) CN25.101(H2-49)
TX_CHN_1: CN20.19(H1-19) CN21.19(H1-19) CN22.19(H1-19) CN23.19(H1-19) CN24.19(H1-19) CN25.19(H1-19)
TX_CHN_2: CN20.59(H2-7) CN21.59(H2-7) CN22.59(H2-7) CN23.59(H2-7) CN24.59(H2-7) CN25.59(H2-7)
V1_E: TP12.1
V2_E: TP13.1
VBAT: TP14.1
VCCIO_EN: TP2.1
VS: TP11.1

Not connected (* = marked no-connect by the designer): MEC1 0*; MEC2 0*; MEC3 0*; MEC4 0*; MEC5 0*; MEC6 0*; MEC7 0*; MEC8 0*

### Layout directives
differential pair: CAN_CHN_1_N, CAN_CHN_1_P, CAN_CHN_2_N, CAN_CHN_2_P, H1_N, H1_P, H2_N, H2_P

### Notes on the sheet
- Title:
- Project:
- SpaceLab - Federal University of Santa Catarina
- Date:
- Engineer:
- Revision:
- Sheet
- of
- Project Code:
- Size:
- A2
- (in symbol PC104, part A) Mouting Module Holes
- (in symbol PC104, part B) Mouting Module Holes
- (in symbol PC104_inverted, part A) Mouting Module Holes
- (in symbol PC104_inverted, part B) Mouting Module Holes

### Library data of the parts
CN20 = PC104_inverted: Manufacturer Part Number: TSW-126-07-G-D
CN21-CN25 = PC104: Manufacturer Part Number: SSW-126-01-G-D
FD1-FD8 = Fiducial 1.3: Fiducial 1.3mm
L2-L4 = RL622-3R3K-RC: 3.3ÂµH Unshielded Wirewound Inductor 5.5A 25mOhm Max Radial, Vertical Cylinder; MF: Bourns; Price: None; Value: *; Package: Radial Bourns - J.W. Miller; Purchase-URL: https://pricing.snapeda.com/search/part/RL622-3R3K-RC/?ref=eda; SnapEDA_Link: https://www.snapeda.com/parts/RL622-3R3K-RC/Bourns/view-part/337281/?ref=snap; Check_prices: https://www.snapeda.com/parts/RL622-3R3K-RC/Bourns/view-part/337281/?ref=eda; Availability: Good; Manufacturer Part Number: RL622-3R3K-RC
MEC1-MEC8 = M3 hole
TP1-TP4 TP11-TP14 = Test Point PTH: TEST POINT PAD

## Sheet voltage_level_translators_schematic.SchDoc: Measurement and voltage translator ICs
size A2; DocumentNumber: 4; SheetNumber: 4; SheetTotal: 8
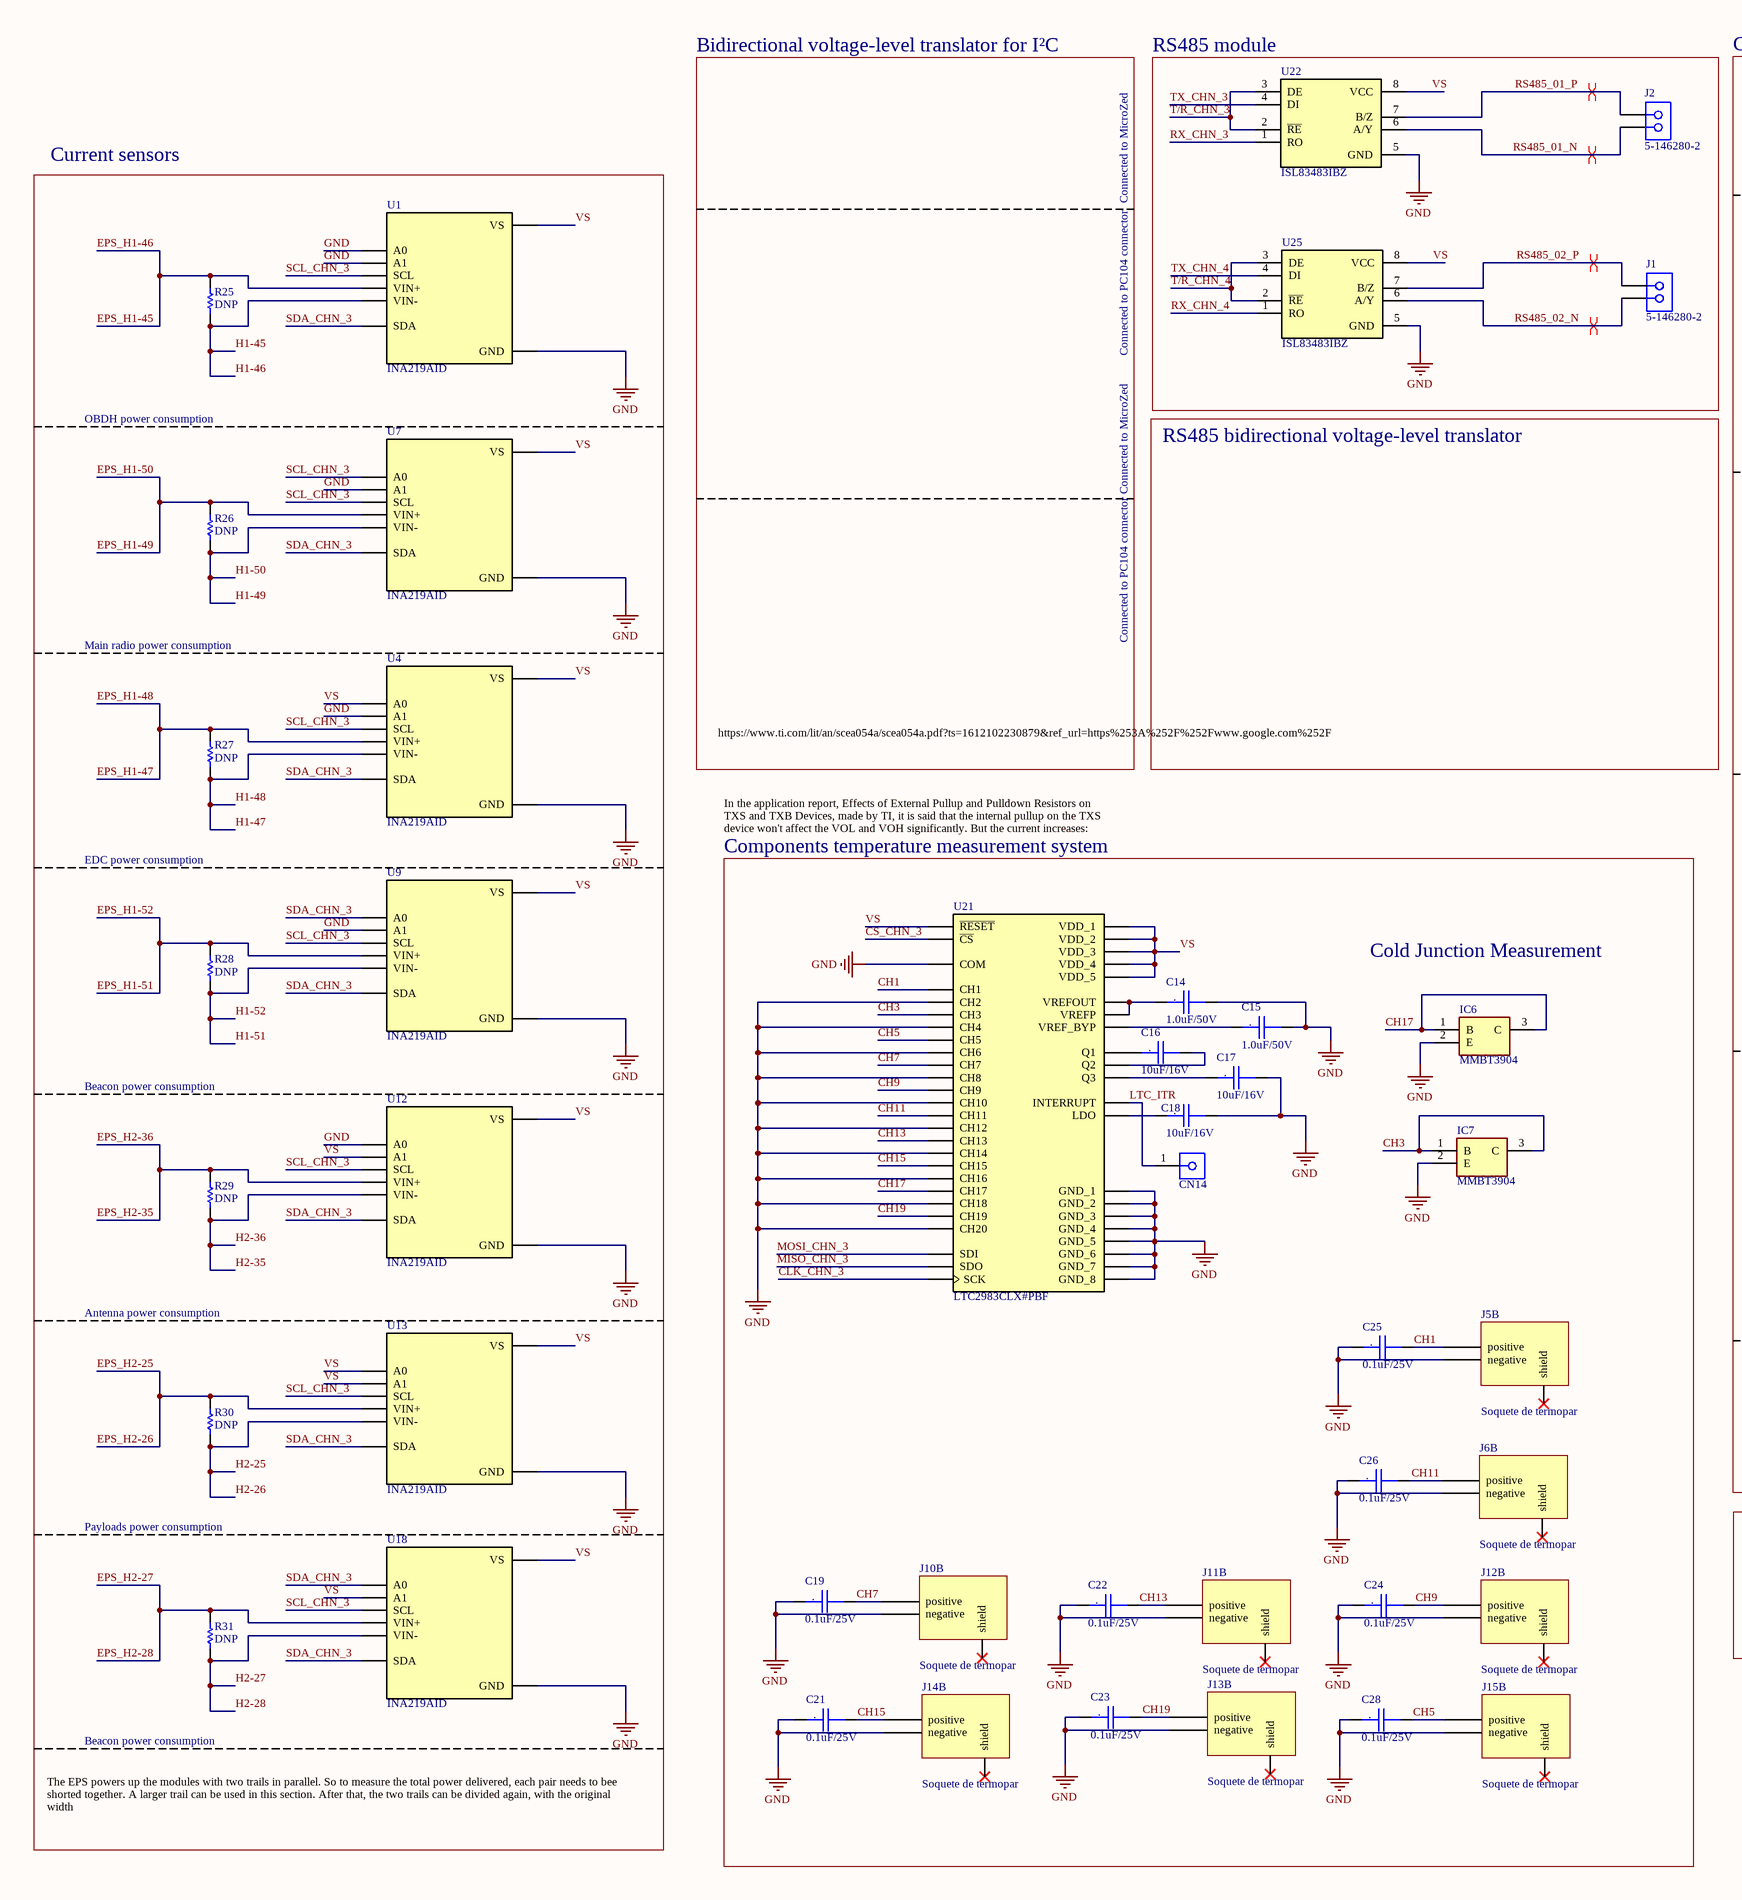
[diagram p4: voltage_level_translators_schematic.SchDoc, left]
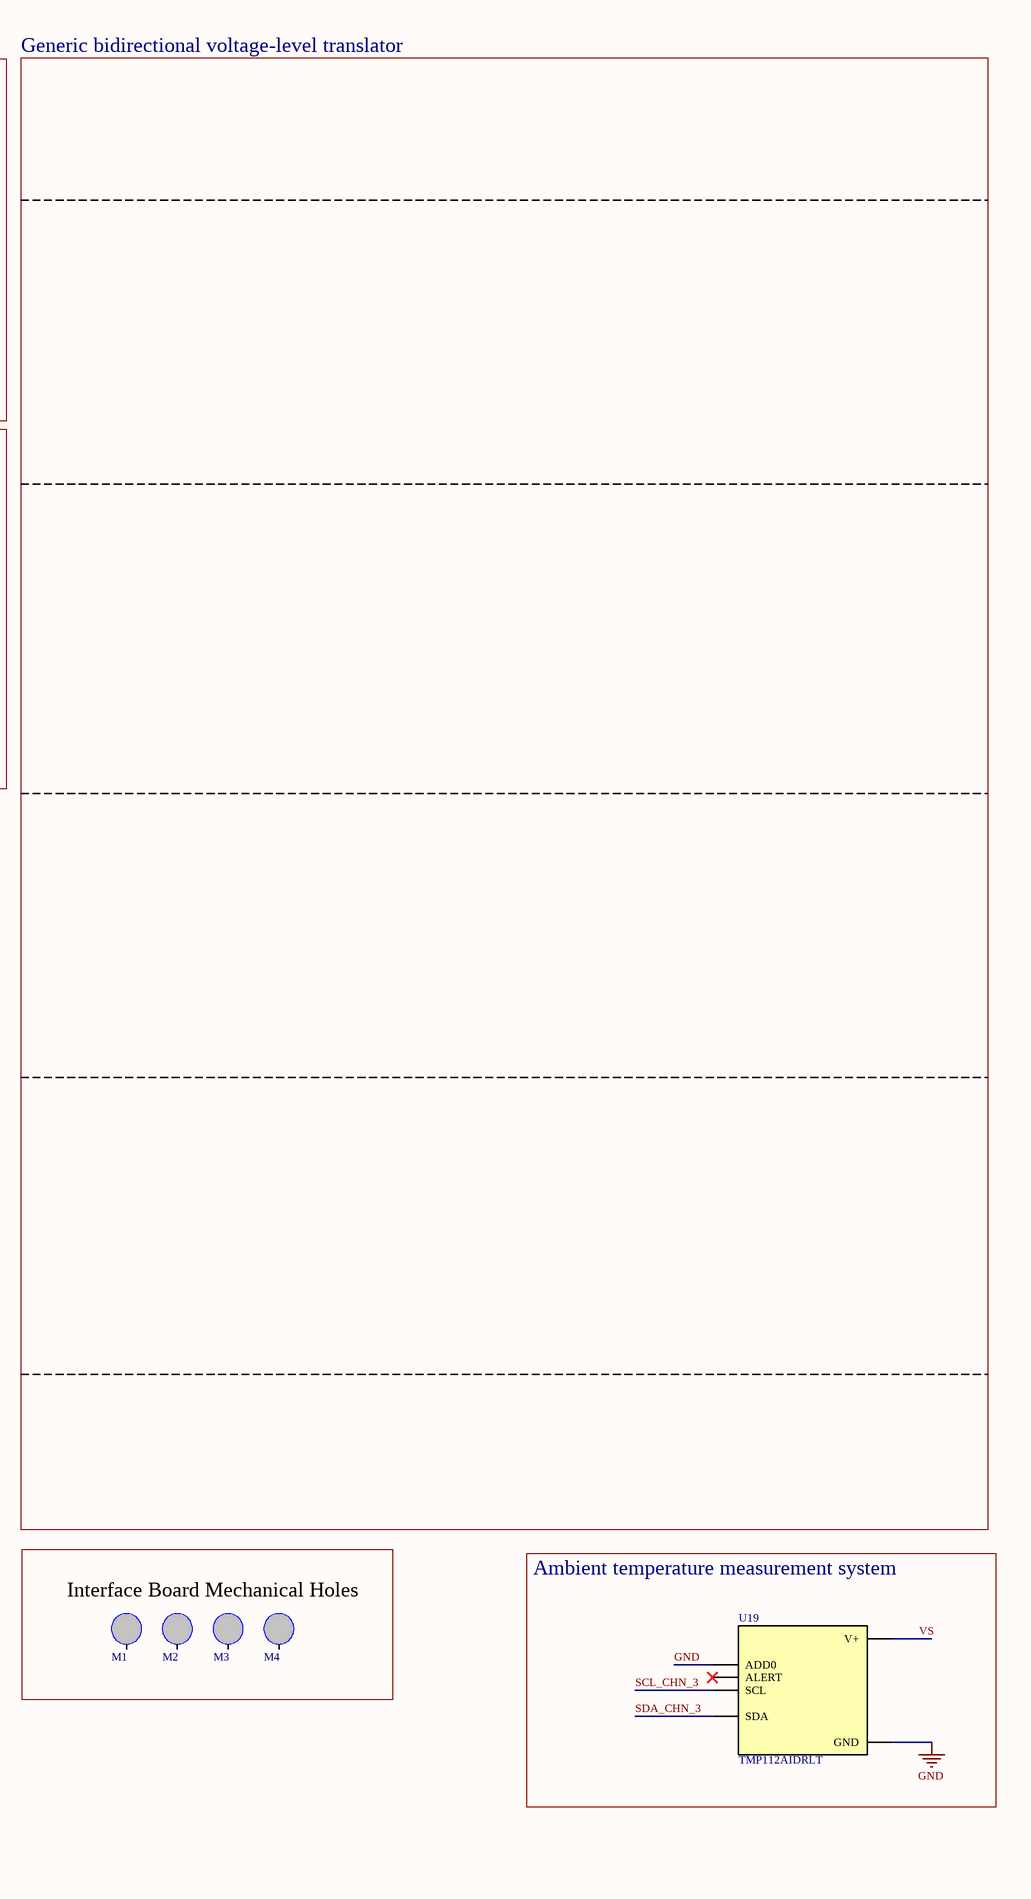
[diagram p5: voltage_level_translators_schematic.SchDoc, right]

### Parts
C14  1.0uF/50V  [CC0805]
C15  1.0uF/50V  [CC0805]
C16  10uF/16V  [CC1210]
C17  10uF/16V  [CC1210]
C18  10uF/16V  [CC1210]
C19  0.1uF/25V  [CC0805]
C21  0.1uF/25V  [CC0805]
C22  0.1uF/25V  [CC0805]
C23  0.1uF/25V  [CC0805]
C24  0.1uF/25V  [CC0805]
C25  0.1uF/25V  [CC0805]
C26  0.1uF/25V  [CC0805]
C28  0.1uF/25V  [CC0805]
CN14  TSW-101-05-T-S  [PIN BAR 1 2.54mm 180 GRAUS - Hide]  (value not drawn)
IC6  MMBT3904  [SOT95P240X120-3N]
IC7  MMBT3904  [SOT95P240X120-3N]
J1  5-146280-2  [PIN BAR 2 2.54mm 180 GRAUS]
J2  5-146280-2  [PIN BAR 2 2.54mm 180 GRAUS]
J5  Soquete de termopar  [PCC-SMP-V-K]  (part B of 2)
J6  Soquete de termopar  [PCC-SMP-V-K]  (part B of 2)
J10  Soquete de termopar  [PCC-SMP-V-K]  (part B of 2)
J11  Soquete de termopar  [PCC-SMP-V-K]  (part B of 2)
J12  Soquete de termopar  [PCC-SMP-V-K]  (part B of 2)
J13  Soquete de termopar  [PCC-SMP-V-K]  (part B of 2)
J14  Soquete de termopar  [PCC-SMP-V-K]  (part B of 2)
J15  Soquete de termopar  [PCC-SMP-V-K]  (part B of 2)
M1  IB Mechanical Hole  [M3 hole (5.5mm pad)]  (value not drawn)  (no BOM)
M2  IB Mechanical Hole  [M3 hole (5.5mm pad)]  (value not drawn)  (no BOM)
M3  IB Mechanical Hole  [M3 hole (5.5mm pad)]  (value not drawn)  (no BOM)
M4  IB Mechanical Hole  [M3 hole (5.5mm pad)]  (value not drawn)  (no BOM)
R25  DNP  [0805]
R26  DNP  [0805]
R27  DNP  [0805]
R28  DNP  [0805]
R29  DNP  [0805]
R30  DNP  [0805]
R31  DNP  [0805]
U1  INA219AID  [SOIC127P599X175-8N]
U4  INA219AID  [SOIC127P599X175-8N]
U7  INA219AID  [SOIC127P599X175-8N]
U9  INA219AID  [SOIC127P599X175-8N]
U12  INA219AID  [SOIC127P599X175-8N]
U13  INA219AID  [SOIC127P599X175-8N]
U18  INA219AID  [SOIC127P599X175-8N]
U19  TMP112AIDRLT  [SOT50P160X60-6N]
U21  LTC2983CLX#PBF  [QFP50P900X900X160-48N]
U22  ISL83483IBZ  [SOIC127P600X175-8N]
U25  ISL83483IBZ  [SOIC127P600X175-8N]

### Blocks framed on the sheet
RS485 module: J1 J2 U22 U25
Current sensors: R25-R31 U1 U4 U7 U9 U12 U13 U18
Interface Board Mechanical Holes: M1-M4
Ambient temperature measurement system: U19

### Nets
GND: C14.2 C15.2 C17.2 C18.2 C19.1 C21.1 C22.1 C23.1 C24.1 C25.1 C26.1 C28.1 IC6.2(E) IC7.2(E) J5.1(negative) J6.1(negative) J10.1(negative) J11.1(negative) J12.1(negative) J13.1(negative) J14.1(negative) J15.1(negative) U1.1(A1) U1.2(A0) U1.6(GND) U4.1(A1) U4.6(GND) U7.1(A1) U7.6(GND) U9.1(A1) U9.6(GND) U12.2(A0) U12.6(GND) U13.6(GND) U18.6(GND) U19.2(GND) U19.4(ADD0) U21.1(GND_1) U21.3(GND_2) U21.5(GND_3) U21.7(GND_4) U21.9(GND_5) U21.12(GND_6) U21.15(GND_7) U21.17(CH2) U21.19(CH4) U21.21(CH6) U21.23(CH8) U21.25(CH10) U21.27(CH12) U21.29(CH14) U21.31(CH16) U21.33(CH18) U21.35(CH20) U21.36(COM) U21.44(GND_8) U22.5(GND) U25.5(GND)
CH1: C25.2 J5.2(positive) U21.16(CH1)
CH3: IC7.1(B) IC7.3(C) U21.18(CH3)
CH5: C28.2 J15.2(positive) U21.20(CH5)
CH7: C19.2 J10.2(positive) U21.22(CH7)
CH9: C24.2 J12.2(positive) U21.24(CH9)
CH11: C26.2 J6.2(positive) U21.26(CH11)
CH13: C22.2 J11.2(positive) U21.28(CH13)
CH15: C21.2 J14.2(positive) U21.30(CH15)
CH17: IC6.1(B) IC6.3(C) U21.32(CH17)
CH19: C23.2 J13.2(positive) U21.34(CH19)
CLK_CHN_3: U21.38(SCK)
CS_CHN_3: U21.41(~{CS})
EPS_H1-45: R25.1 U1.8(VIN+)  [also labelled EPS_H1-46]
EPS_H1-47: R27.1 U4.8(VIN+)  [also labelled EPS_H1-48]
EPS_H1-49: R26.1 U7.8(VIN+)  [also labelled EPS_H1-50]
EPS_H1-51: R28.1 U9.8(VIN+)  [also labelled EPS_H1-52]
EPS_H2-25: R30.1 U13.8(VIN+)  [also labelled EPS_H2-26]
EPS_H2-27: R31.1 U18.8(VIN+)  [also labelled EPS_H2-28]
EPS_H2-35: R29.1 U12.8(VIN+)  [also labelled EPS_H2-36]
H1-45: R25.2 U1.7(VIN-)  [also labelled H1-46]
H1-47: R27.2 U4.7(VIN-)  [also labelled H1-48]
H1-49: R26.2 U7.7(VIN-)  [also labelled H1-50]
H1-51: R28.2 U9.7(VIN-)  [also labelled H1-52]
H2-25: R30.2 U13.7(VIN-)  [also labelled H2-26]
H2-27: R31.2 U18.7(VIN-)  [also labelled H2-28]
H2-35: R29.2 U12.7(VIN-)  [also labelled H2-36]
LTC_ITR: CN14.1 U21.37(INTERRUPT)
MISO_CHN_3: U21.39(SDO)
MOSI_CHN_3: U21.40(SDI)
RS485_01_N: J2.2 U22.6(A/Y)
RS485_01_P: J2.1 U22.7(B/Z)
RS485_02_N: J1.2 U25.6(A/Y)
RS485_02_P: J1.1 U25.7(B/Z)
RX_CHN_3: U22.1(RO)
RX_CHN_4: U25.1(RO)
SCL_CHN_3: U1.4(SCL) U4.4(SCL) U7.2(A0) U7.4(SCL) U9.4(SCL) U12.4(SCL) U13.4(SCL) U18.4(SCL) U19.1(SCL)
SDA_CHN_3: U1.3(SDA) U4.3(SDA) U7.3(SDA) U9.2(A0) U9.3(SDA) U12.3(SDA) U13.3(SDA) U18.2(A0) U18.3(SDA) U19.6(SDA)
T/R_CHN_3: U22.2(~{RE}) U22.3(DE)
T/R_CHN_4: U25.2(~{RE}) U25.3(DE)
TX_CHN_3: U22.4(DI)
TX_CHN_4: U25.4(DI)
VS: U1.5(VS) U4.2(A0) U4.5(VS) U7.5(VS) U9.5(VS) U12.1(A1) U12.5(VS) U13.1(A1) U13.2(A0) U13.5(VS) U18.1(A1) U18.5(VS) U19.5(V+) U21.2(VDD_1) U21.4(VDD_2) U21.6(VDD_3) U21.8(VDD_4) U21.42(~{RESET}) U21.45(VDD_5) U22.8(VCC) U25.8(VCC)
NetC14_1: C14.1 U21.13(VREFOUT) U21.14(VREFP)
NetC15_1: C15.1 U21.11(VREF_BYP)
NetC16_1: C16.1 U21.48(Q1)
NetC16_2: C16.2 U21.47(Q2)
NetC17_1: C17.1 U21.46(Q3)
NetC18_1: C18.1 U21.43(LDO)

Not connected (* = marked no-connect by the designer): J5 3(shield)*; J6 3(shield)*; J10 3(shield)*; J11 3(shield)*; J12 3(shield)*; J13 3(shield)*; J14 3(shield)*; J15 3(shield)*; M1 0; M2 0; M3 0; M4 0; U19 3(ALERT)*

### Layout directives
differential pair: RS485_01_N, RS485_01_P, RS485_02_N, RS485_02_P

### Notes on the sheet
- Bidirectional voltage-level translator for I²C
- Generic bidirectional voltage-level translator
- Connected to MicroZed
- Connected to PC104 connector
- OBDH power consumption
- RS485 bidirectional voltage-level translator
- Main radio power consumption
- https://www.ti.com/lit/an/scea054a/scea054a.pdf?ts=1612102230879&ref_url=https%253A%252F%252Fwww.google.com%252F
- In the application report, Effects of External Pullup and Pulldown Resistors on TXS and TXB Devices, made by TI, it is said that the internal pullup on the TXS device won't affect the VOL and VOH significantly. But the current increases:
- EDC power consumption
- Components temperature measurement system
- Cold Junction Measurement
- Beacon power consumption
- Antenna power consumption
- Payloads power consumption
- The EPS powers up the modules with two trails in parallel. So to measure the total power delivered, each pair needs to bee shorted together. A larger trail can be used in this section. After that, the two trails can be divided again, with the original width
- Title:
- Project:
- SpaceLab - Federal University of Santa Catarina
- Date:
- Engineer:
- Revision:
- Sheet
- of
- Project Code:
- Size:
- A2
- (in symbol Cap_Cer_X7R_0.1uF_25V_0805) .
- (in symbol Cap_Cer_X7R_1.0uF_50V_0805) .
- (in symbol Cap_Cer_X7R_10uF_16V_1210) .

### Library data of the parts
C14 C15 = Cap_Cer_X7R_1.0uF_50V_0805: CAP CER 1.0uF 50V 10% X7R 0805; Manufacturer Part Number: C0805X105K5RACAUTO; NCM: 8532.24.10
C16-C18 = Cap_Cer_X7R_10uF_16V_1210: CAP CER 10uF 16V 10% X7R 1210; Manufacturer Part Number: C1210C106K4RACTU; NCM: 8532.24.10
C19 C21-C26 C28 = Cap_Cer_X7R_0.1uF_25V_0805: CAP CER 0.1uF 25V 10% X7R 0805; Manufacturer Part Number: CC0805KRX7R8BB104; NCM: 8532.24.10
CN14 = TSW-101-05-T-S: CONN HEADER 1POS .100" SNGL TIN; Manufacturer: Samtec Inc; N of Positions: 2; Pitch: 2.54mm; Mount Type: PTH; Supplier 1: Farnell; Supplier Part Number 1: 1925384; Supplier 2: Newark; Supplier Part Number 2: 84T5043; Supplier 3: Digi-Key; Supplier Part Number 3: SAM1019-02-ND; Supplier 4: Arrow; Supplier Part Number 4: T9xGEsh_w6igb0LY4EP_nwsWhIkhCEmR3qLYTGm2XzA; Supplier 5: Digi-Key; Supplier Part Number 5: SAM1019-01-ND; Supplier 6: Newark; Supplier Part Number 6: 69X6269; Manufacturer Part Number: TSW-101-05-T-S
IC6 IC7 = MMBT3904: Integrated Circuit; Manufacturer_Name: Diotec; Datasheet Link: https://media.digikey.com/pdf/Data%20Sheets/ON%20Semiconductor%20PDFs/2N3904,MMBT3904,PZT3904.pdf; Height: 1.2mm; Manufacturer_Part_Number: MMBT3904; Mouser Part Number: 637-MMBT3904; Mouser Price/Stock: https://www.mouser.co.uk/ProductDetail/Diotec-Semiconductor/MMBT3904?qs=OlC7AqGiEDkK1MwiyUU6mg%3D%3D; Arrow Part Number: MMBT3904; Arrow Price/Stock: https://www.arrow.com/en/products/mmbt3904/diotec-semiconductor-ag?utm_currency=USD&region=europe
J1 J2 = 5-146280-2: 02 MODII HDR SRST B/A .100CL; MF: TE Connectivity; Product_Type: Connector; Number_of_Positions: 2; Centerline_Pitch: 2.54 mm[.1 in]; SnapEDA_Link: https://www.snapeda.com/parts/5-146280-2/TE%20Connectivity%20AMP%20Connectors/view-part/298520/?ref=snap; Price: None; EU_RoHS_Compliance: Compliant; Package: None; Availability: Unavailable; TE_purchase_URL: https://www.te.com/usa-en/product-5-146280-2.html?te_bu=Cor&te_type=disp&te_campaign=seda_glo_cor-seda-global-disp-prtnr-fy19-seda-model-bom-cta_sma-317_1&elqCampaignId=32493; Value: *; Manufacturer Part Number: 5-146280-2
J5 J6 J10-J15 = PCC-SMP-V-K: Soquete de termopar especial PCCS para placa de circuito em série; ComponentLink1Description: Datasheet; ComponentLink1URL: https://assets.omega.com/spec/PCC-OST-SMP_spec.pdf
M1-M4 = IB Mechanical Hole: Mechanical Hole for FloripaSat-2 interface boards
R25-R31 = RDNP_0805: RES DNP 0805; Manufacturer Part Number: UR73V2ATTD47L0F; NCM: 8533.21.20
U1 U4 U7 U9 U12 U13 U18 = INA219AID: 26V, 12-bit, i2c output current/voltage/power monitor 8-SOIC -40 to 125; MF: Texas Instruments; Purchase-URL: https://pricing.snapeda.com/search/part/INA219AID/?ref=eda; Package: SOIC-8 Texas Instruments; SnapEDA_Link: https://www.snapeda.com/parts/INA219AID/Texas%20Instruments/view-part/522322/?ref=snap; Value: *; Price: None; Availability: Warning; Check_prices: https://www.snapeda.com/parts/INA219AID/Texas%20Instruments/view-part/522322/?ref=eda; Manufacturer Part Number: INA219AID
U19 = TMP112AIDRLT: 0.5C 1.4V to 3.6V digital temperature sensor with I2C/SMBus in 2.56mm2 package 6-SOT-5X3 -40 to 125; MF: Texas Instruments; Texas_Instruments-Purchase-URL: https://snapeda.com/shop?store=Texas+Instruments&id=237309; Price: None; Mouser-Purchase-URL: https://snapeda.com/shop?store=Mouser&id=237309; Availability: Good; Package: SOT-5X3-6 Texas Instruments; SnapEDA_Link: https://www.snapeda.com/parts/TMP112AIDRLT/Texas%20Instruments/view-part/237309/?ref=snap; DigiKey-Purchase-URL: https://snapeda.com/shop?store=DigiKey&id=237309; Value: *; Manufacturer Part Number: TMP112AIDRLT
U21 = LTC2983CLX#PBF: IC SENSOR THERMAL; MF: Analog Devices; Value: *; SnapEDA_Link: https://www.snapeda.com/parts/LTC2983CLX%23PBF/Analog%20Devices/view-part/2895071/?ref=snap; Package: LQFP -48 Analog Devices; Manufacturer Part Number: LTC2983CLX#PBF
U22 U25 = ISL83483IBZ: 1/1 Transceiver Half RS422, RS485 8-SOIC; Manufacturer Part Number: ISL83483IBZ-T; MF: Renesas Electronics; Price: None; SnapEDA_Link: https://www.snapeda.com/parts/ISL83483IBZ-T/Renesas%20Electronics%20America%20Inc./view-part/482105/?ref=snap; Availability: Unavailable; Value: *; Package: SOIC-8 Intersil

## Sheet CAN_schematic.SchDoc: CAN transceiver and test switches
size A4; Organization: UFSC; DocumentNumber: 5; Revision: v0.1; SheetNumber: 5; SheetTotal: 8; ProjectCode: FLATSAT2
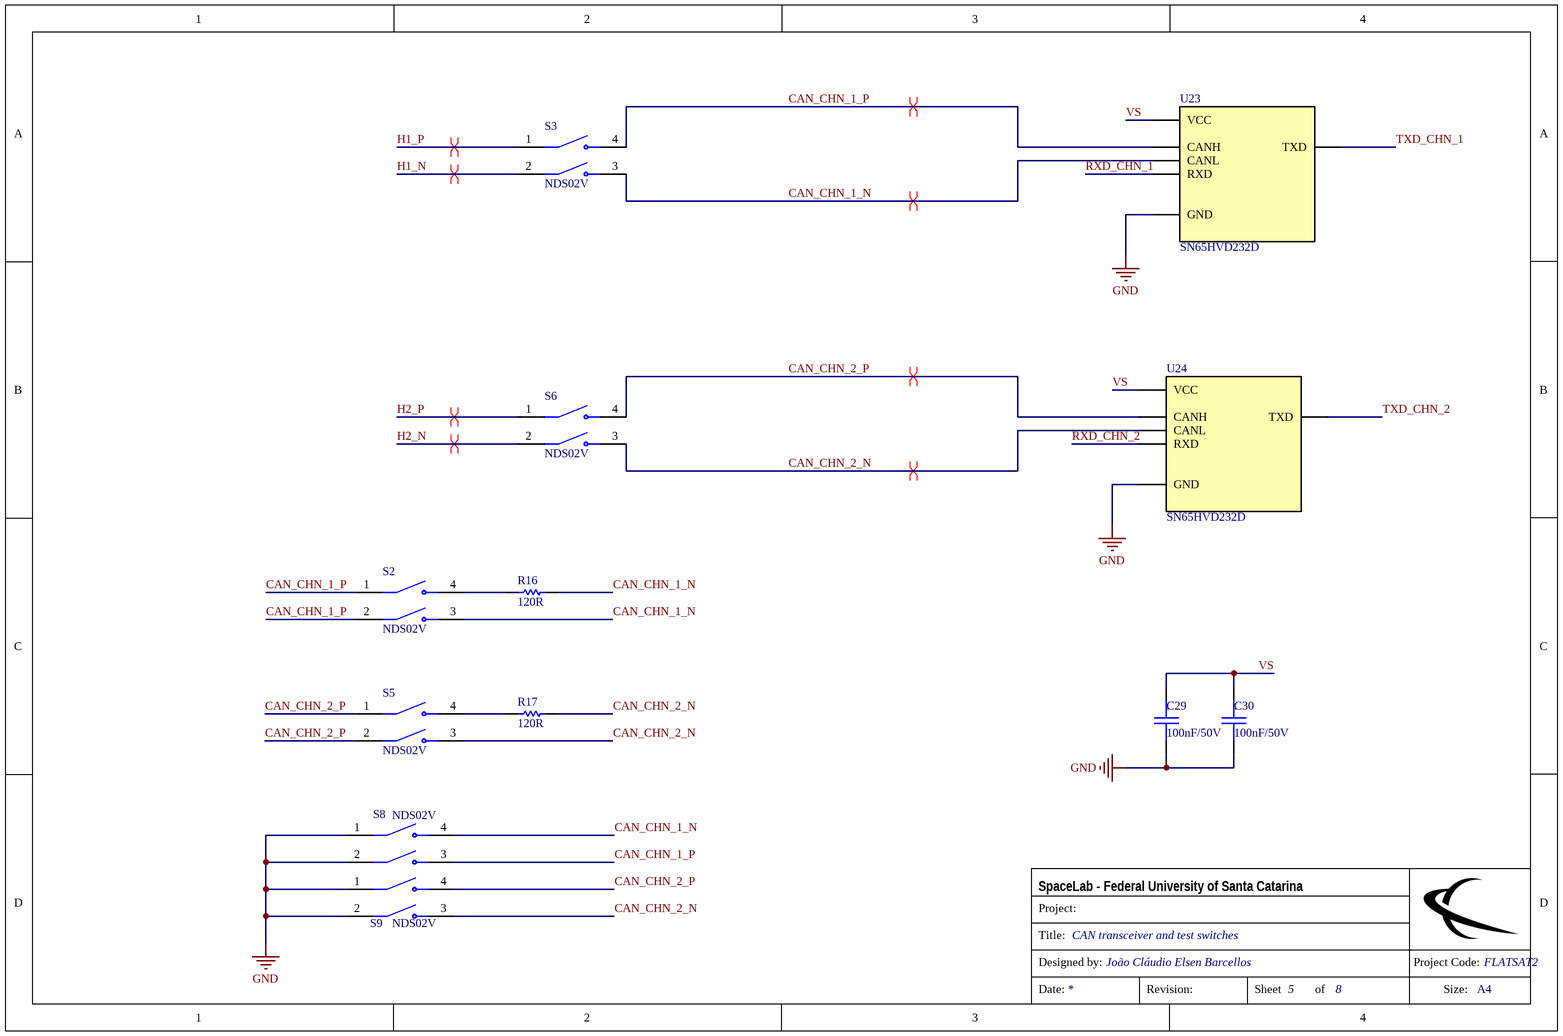
[diagram p6: CAN_schematic.SchDoc]

### Parts
C29  100nF/50V  [CC0603]
C30  100nF/50V  [CC0603]
R16  120R  [0805]
R17  120R  [0805]
S2  NDS02V  [NDS02V]
S3  NDS02V  [NDS02V]
S5  NDS02V  [NDS02V]
S6  NDS02V  [NDS02V]
S8  NDS02V  [NDS02V]
S9  NDS02V  [NDS02V]
U23  SN65HVD232D  [SOIC127P599X175-8N]
U24  SN65HVD232D  [SOIC127P599X175-8N]

### Nets
GND: C29.2 C30.2 S8.1(COM_1) S8.2(COM_2) S9.1(COM_1) S9.2(COM_2) U23.2(GND) U24.2(GND)
CAN_CHN_1_N: R16.1 S2.3(NO_1) S3.3(NO_1) S8.4(NO_2) U23.6(CANL)
CAN_CHN_1_P: S2.1(COM_1) S2.2(COM_2) S3.4(NO_2) S8.3(NO_1) U23.7(CANH)
CAN_CHN_2_N: R17.1 S5.3(NO_1) S6.3(NO_1) S9.3(NO_1) U24.6(CANL)
CAN_CHN_2_P: S5.1(COM_1) S5.2(COM_2) S6.4(NO_2) S9.4(NO_2) U24.7(CANH)
H1_N: S3.2(COM_2)
H1_P: S3.1(COM_1)
H2_N: S6.2(COM_2)
H2_P: S6.1(COM_1)
RXD_CHN_1: U23.4(RXD)
RXD_CHN_2: U24.4(RXD)
TXD_CHN_1: U23.1(TXD)
TXD_CHN_2: U24.1(TXD)
VS: C29.1 C30.1 U23.3(VCC) U24.3(VCC)
NetR16_2: R16.2 S2.4(NO_2)
NetR17_2: R17.2 S5.4(NO_2)

### Layout directives
differential pair: CAN_CHN_1_N, CAN_CHN_1_P, CAN_CHN_2_N, CAN_CHN_2_P, H1_N, H1_P, H2_N, H2_P

### Notes on the sheet
- Project:
- SpaceLab - Federal University of Santa Catarina
- Title:
- Designed by:
- Project Code:
- Date:
- Revision:
- Sheet
- of
- Size:
- A4
- (in symbol Cap_Cer_X7R_100nF_50V_0603) .

### Library data of the parts
C29 C30 = Cap_Cer_X7R_100nF_50V_0603: CAP CER 100nF 50V 10% X7R 0603; Manufacturer Part Number: C0603C104K5RAC3121; NCM: 8532.24.10
R16 R17 = R120R_1%_1/4W_0805: RES 120R OHM 1/8W 1% 0805; Manufacturer Part Number: CRGCQ0805F120R; NCM: 8533.21.20
S2 S3 S5 S6 S8 S9 = NDS02V: Switch; Manufacturer_Name: Apem; Datasheet Link: https://componentsearchengine.com/Datasheets/2/NDS02V.pdf; Height: 7.05mm; Manufacturer_Part_Number: NDS02V; Mouser Part Number: 642-NDS02V; Mouser Price/Stock: https://www.mouser.co.uk/ProductDetail/Apem/NDS02V?qs=Rt2YTNbomKgQBAMS%252Bs5rFQ%3D%3D
U23 U24 = SN65HVD232D: 3.3 V CAN Transceiver; MF: Texas Instruments; Availability: Unavailable; Package: SOIC-8 Texas Instruments; DigiKey-Purchase-URL: https://snapeda.com/shop?store=DigiKey&id=230614; SnapEDA_Link: https://www.snapeda.com/parts/SN65HVD232D/Texas%20Instruments/view-part/230614/?ref=snap; Mouser-Purchase-URL: https://snapeda.com/shop?store=Mouser&id=230614; Value: *; Price: None; Texas_Instruments-Purchase-URL: https://snapeda.com/shop?store=Texas+Instruments&id=230614; Manufacturer Part Number: SN65HVD232D